# Altium project ASBB.PrjPcb (part 1 of 2)
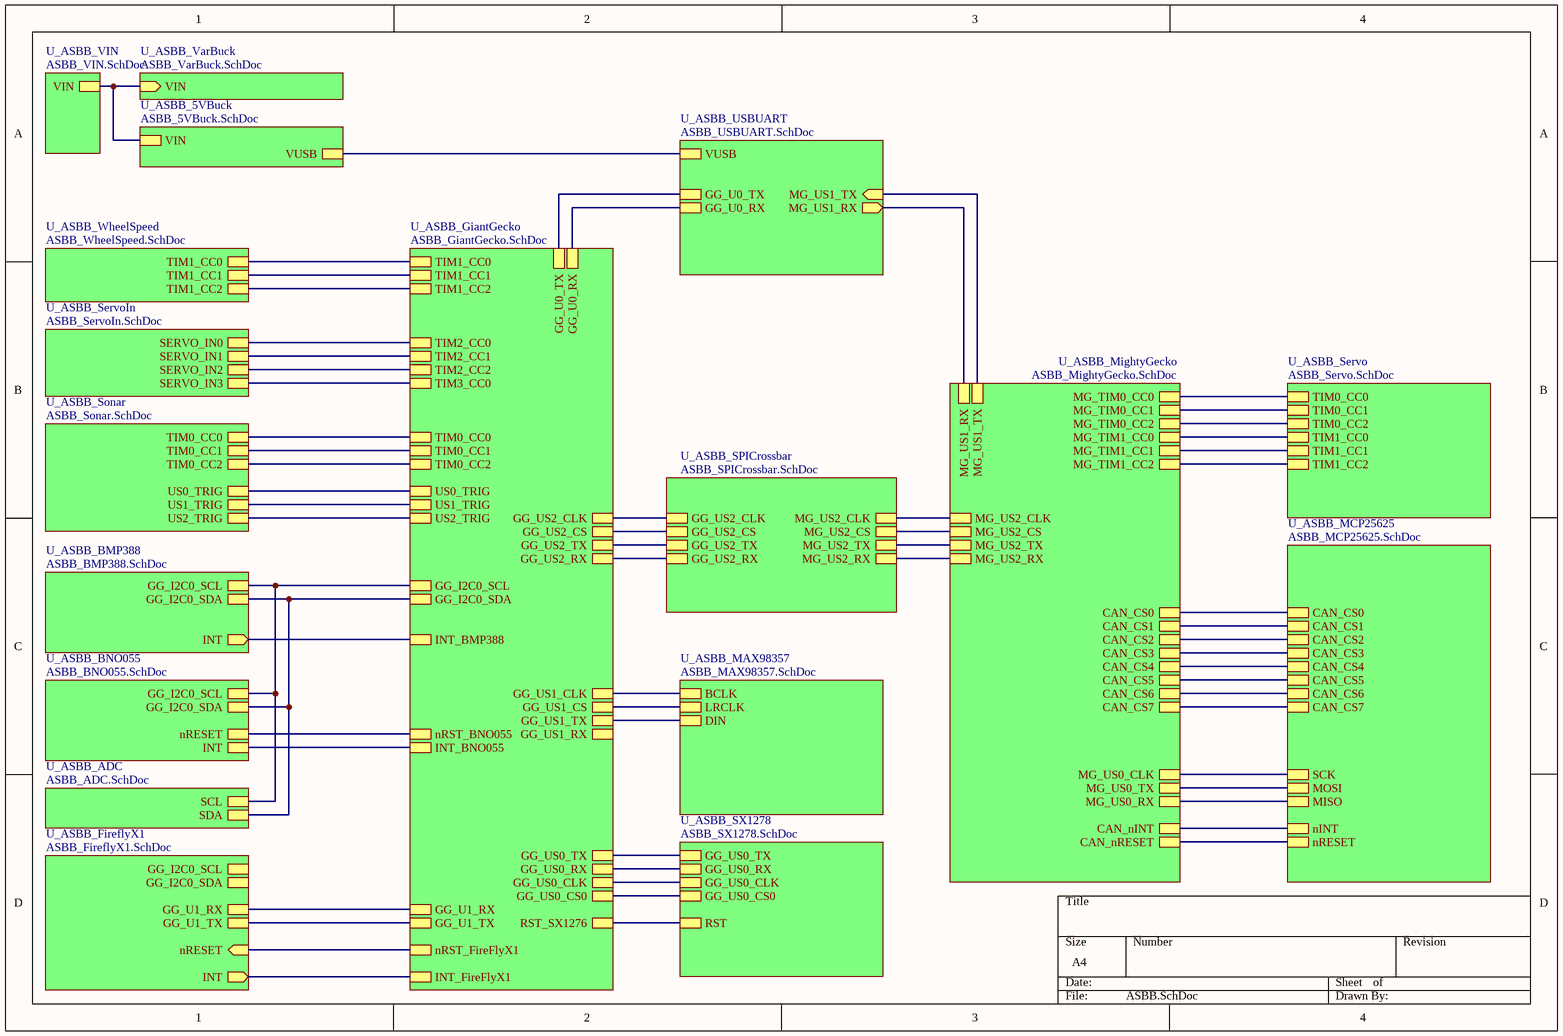
[diagram p0: ASBB.SchDoc]
19 sheets, 226 parts. Net scope: hierarchical (ports join the sheet entries above them; power ports are global).
Board file: ASBB.PcbDoc
Sheets:
  ASBB.SchDoc
    U_ASBB_VarBuck = ASBB_VarBuck.SchDoc
    U_ASBB_5VBuck = ASBB_5VBuck.SchDoc
    U_ASBB_USBUART = ASBB_USBUART.SchDoc
    U_ASBB_BMP388 = ASBB_BMP388.SchDoc
    U_ASBB_BNO055 = ASBB_BNO055.SchDoc
    U_ASBB_MAX98357 = ASBB_MAX98357.SchDoc
    U_ASBB_MCP25625 = ASBB_MCP25625.SchDoc
    U_ASBB_FireflyX1 = ASBB_FireflyX1.SchDoc
    U_ASBB_SX1278 = ASBB_SX1278.SchDoc
    U_ASBB_GiantGecko = ASBB_GiantGecko.SchDoc
    U_ASBB_Servo = ASBB_Servo.SchDoc
    U_ASBB_MightyGecko = ASBB_MightyGecko.SchDoc
    U_ASBB_SPICrossbar = ASBB_SPICrossbar.SchDoc
    U_ASBB_Sonar = ASBB_Sonar.SchDoc
    U_ASBB_WheelSpeed = ASBB_WheelSpeed.SchDoc
    U_ASBB_VIN = ASBB_VIN.SchDoc
    U_ASBB_ADC = ASBB_ADC.SchDoc
    U_ASBB_ServoIn = ASBB_ServoIn.SchDoc

## Sheet ASBB.SchDoc
size A4

### Sub-sheets
U_ASBB_5VBuck = ASBB_5VBuck.SchDoc: VIN, VUSB
U_ASBB_ADC = ASBB_ADC.SchDoc: SDA, SCL
U_ASBB_BMP388 = ASBB_BMP388.SchDoc: INT (out), GG_I2C0_SCL, GG_I2C0_SDA
U_ASBB_BNO055 = ASBB_BNO055.SchDoc: INT, GG_I2C0_SCL, GG_I2C0_SDA, nRESET
U_ASBB_FireflyX1 = ASBB_FireflyX1.SchDoc: INT (out), nRESET (in), GG_U1_TX, GG_I2C0_SCL, GG_U1_RX, GG_I2C0_SDA
U_ASBB_GiantGecko = ASBB_GiantGecko.SchDoc: GG_U0_TX, GG_US1_CLK, GG_US0_CS0, GG_US2_RX, GG_U1_RX, GG_US2_CLK, GG_US1_TX, GG_US0_TX, GG_US2_TX, GG_US1_RX, GG_I2C0_SDA, GG_U1_TX, GG_US2_CS, GG_U0_RX, GG_US0_RX, GG_US1_CS, GG_US0_CLK, GG_I2C0_SCL, INT_BNO055, INT_BMP388, nRST_FireFlyX1, INT_FireFlyX1, RST_SX1276, TIM1_CC1, TIM0_CC0, TIM1_CC0, TIM0_CC2, TIM1_CC2, TIM0_CC1, US2_TRIG, US1_TRIG, US0_TRIG, nRST_BNO055, TIM2_CC0, TIM3_CC0, TIM2_CC2, TIM2_CC1
U_ASBB_MAX98357 = ASBB_MAX98357.SchDoc: BCLK, LRCLK, DIN
U_ASBB_MCP25625 = ASBB_MCP25625.SchDoc: SCK, MOSI, MISO, CAN_CS7, CAN_CS1, CAN_CS4, CAN_CS5, CAN_CS0, CAN_CS3, CAN_CS6, CAN_CS2, nINT, nRESET
U_ASBB_MightyGecko = ASBB_MightyGecko.SchDoc: MG_US0_CLK, MG_US0_RX, MG_US0_TX, MG_US2_CLK, MG_US2_RX, MG_US2_TX, MG_US2_CS, MG_US1_RX, MG_US1_TX, MG_TIM0_CC0, MG_TIM1_CC0, MG_TIM0_CC1, MG_TIM0_CC2, CAN_nRESET, MG_TIM1_CC1, MG_TIM1_CC2, CAN_CS1, CAN_CS0, CAN_CS6, CAN_CS2, CAN_CS4, CAN_CS7, CAN_CS5, CAN_CS3, CAN_nINT
U_ASBB_Servo = ASBB_Servo.SchDoc: TIM0_CC0, TIM0_CC1, TIM0_CC2, TIM1_CC0, TIM1_CC1, TIM1_CC2
U_ASBB_ServoIn = ASBB_ServoIn.SchDoc: SERVO_IN0, SERVO_IN2, SERVO_IN1, SERVO_IN3
U_ASBB_Sonar = ASBB_Sonar.SchDoc: TIM0_CC0, US0_TRIG, TIM0_CC1, US1_TRIG, TIM0_CC2, US2_TRIG
U_ASBB_SPICrossbar = ASBB_SPICrossbar.SchDoc: GG_US2_CLK, GG_US2_TX, GG_US2_CS, MG_US2_CLK, MG_US2_TX, MG_US2_RX, MG_US2_CS, GG_US2_RX
U_ASBB_SX1278 = ASBB_SX1278.SchDoc: RST, GG_US0_TX, GG_US0_RX, GG_US0_CLK, GG_US0_CS0
U_ASBB_USBUART = ASBB_USBUART.SchDoc: GG_U0_TX, GG_U0_RX, MG_US1_TX (in), MG_US1_RX (out), VUSB
U_ASBB_VarBuck = ASBB_VarBuck.SchDoc: VIN (in)
U_ASBB_VIN = ASBB_VIN.SchDoc: VIN
U_ASBB_WheelSpeed = ASBB_WheelSpeed.SchDoc: TIM1_CC0, TIM1_CC1, TIM1_CC2

### Nets
GG_US0_CLK: sheet U_ASBB_SX1278/GG_US0_CLK, sheet U_ASBB_GiantGecko/GG_US0_CLK
GG_US0_RX: sheet U_ASBB_SX1278/GG_US0_RX, sheet U_ASBB_GiantGecko/GG_US0_RX
GG_US0_TX: sheet U_ASBB_SX1278/GG_US0_TX, sheet U_ASBB_GiantGecko/GG_US0_TX
HPC_CS0: sheet U_ASBB_GiantGecko/GG_US2_CS, sheet U_ASBB_SPICrossbar/GG_US2_CS
HPC_CS1: sheet U_ASBB_MightyGecko/MG_US2_CS, sheet U_ASBB_SPICrossbar/MG_US2_CS
HPC_MISO: sheet U_ASBB_GiantGecko/GG_US2_TX, sheet U_ASBB_SPICrossbar/GG_US2_TX
HPC_MOSI: sheet U_ASBB_GiantGecko/GG_US2_RX, sheet U_ASBB_SPICrossbar/GG_US2_RX
HPC_SCK: sheet U_ASBB_GiantGecko/GG_US2_CLK, sheet U_ASBB_MightyGecko/MG_US2_CLK, sheet U_ASBB_SPICrossbar/GG_US2_CLK, sheet U_ASBB_SPICrossbar/MG_US2_CLK
V_IN: sheet U_ASBB_VarBuck/VIN, sheet U_ASBB_5VBuck/VIN, sheet U_ASBB_VIN/VIN
NetB501_13: sheet U_ASBB_FireflyX1/INT, sheet U_ASBB_GiantGecko/INT_FireFlyX1
NetB501_19: sheet U_ASBB_FireflyX1/nRESET, sheet U_ASBB_GiantGecko/nRST_FireFlyX1
NetC1404_2: sheet U_ASBB_5VBuck/VUSB, sheet U_ASBB_USBUART/VUSB
NetIC601_1: sheet U_ASBB_GiantGecko/TIM3_CC0, sheet U_ASBB_ServoIn/SERVO_IN3
NetIC601_9: sheet U_ASBB_GiantGecko/TIM1_CC0, sheet U_ASBB_WheelSpeed/TIM1_CC0
NetIC601_10: sheet U_ASBB_GiantGecko/TIM1_CC1, sheet U_ASBB_WheelSpeed/TIM1_CC1
NetIC601_11: sheet U_ASBB_GiantGecko/TIM1_CC2, sheet U_ASBB_WheelSpeed/TIM1_CC2
NetIC601_18: sheet U_ASBB_MAX98357/LRCLK, sheet U_ASBB_GiantGecko/GG_US1_CS
NetIC601_19: sheet U_ASBB_MAX98357/DIN, sheet U_ASBB_GiantGecko/GG_US1_TX
NetIC601_21: sheet U_ASBB_MAX98357/BCLK, sheet U_ASBB_GiantGecko/GG_US1_CLK
NetIC601_22: sheet U_ASBB_GiantGecko/TIM0_CC0, sheet U_ASBB_Sonar/TIM0_CC0
NetIC601_23: sheet U_ASBB_GiantGecko/TIM0_CC1, sheet U_ASBB_Sonar/TIM0_CC1
NetIC601_26: sheet U_ASBB_GiantGecko/TIM0_CC2, sheet U_ASBB_Sonar/TIM0_CC2
NetIC601_27: sheet U_ASBB_GiantGecko/TIM2_CC0, sheet U_ASBB_ServoIn/SERVO_IN0
NetIC601_28: sheet U_ASBB_GiantGecko/TIM2_CC1, sheet U_ASBB_ServoIn/SERVO_IN1
NetIC601_29: sheet U_ASBB_GiantGecko/TIM2_CC2, sheet U_ASBB_ServoIn/SERVO_IN2
NetIC601_54: sheet U_ASBB_BMP388/INT, sheet U_ASBB_GiantGecko/INT_BMP388
NetIC601_61: sheet U_ASBB_BNO055/nRESET, sheet U_ASBB_GiantGecko/nRST_BNO055
NetIC601_64: sheet U_ASBB_BMP388/GG_I2C0_SDA, sheet U_ASBB_BNO055/GG_I2C0_SDA, sheet U_ASBB_GiantGecko/GG_I2C0_SDA, sheet U_ASBB_ADC/SDA
NetIC601_65: sheet U_ASBB_BMP388/GG_I2C0_SCL, sheet U_ASBB_BNO055/GG_I2C0_SCL, sheet U_ASBB_GiantGecko/GG_I2C0_SCL, sheet U_ASBB_ADC/SCL
NetIC601_67: sheet U_ASBB_GiantGecko/US0_TRIG, sheet U_ASBB_Sonar/US0_TRIG
NetIC601_68: sheet U_ASBB_BNO055/INT, sheet U_ASBB_GiantGecko/INT_BNO055
NetIC601_71: sheet U_ASBB_SX1278/RST, sheet U_ASBB_GiantGecko/RST_SX1276
NetIC601_75: sheet U_ASBB_FireflyX1/GG_U1_TX, sheet U_ASBB_GiantGecko/GG_U1_TX
NetIC601_80: sheet U_ASBB_FireflyX1/GG_U1_RX, sheet U_ASBB_GiantGecko/GG_U1_RX
NetIC601_84: sheet U_ASBB_USBUART/GG_U0_TX, sheet U_ASBB_GiantGecko/GG_U0_TX
NetIC601_85: sheet U_ASBB_USBUART/GG_U0_RX, sheet U_ASBB_GiantGecko/GG_U0_RX
NetIC601_87: sheet U_ASBB_SX1278/GG_US0_CS0, sheet U_ASBB_GiantGecko/GG_US0_CS0
NetIC601_92: sheet U_ASBB_GiantGecko/US1_TRIG, sheet U_ASBB_Sonar/US1_TRIG
NetIC601_93: sheet U_ASBB_GiantGecko/US2_TRIG, sheet U_ASBB_Sonar/US2_TRIG
NetIC901_4: sheet U_ASBB_MCP25625/nINT, sheet U_ASBB_MightyGecko/CAN_nINT
NetIC901_18: sheet U_ASBB_MightyGecko/MG_US2_TX, sheet U_ASBB_SPICrossbar/MG_US2_TX
NetIC901_19: sheet U_ASBB_MCP25625/MOSI, sheet U_ASBB_MightyGecko/MG_US0_TX
NetIC901_20: sheet U_ASBB_MCP25625/MISO, sheet U_ASBB_MightyGecko/MG_US0_RX
NetIC901_21: sheet U_ASBB_MCP25625/SCK, sheet U_ASBB_MightyGecko/MG_US0_CLK
NetIC901_28: sheet U_ASBB_MCP25625/CAN_CS5, sheet U_ASBB_MightyGecko/CAN_CS5
NetIC901_29: sheet U_ASBB_MCP25625/CAN_CS4, sheet U_ASBB_MightyGecko/CAN_CS4
NetIC901_30: sheet U_ASBB_Servo/TIM1_CC2, sheet U_ASBB_MightyGecko/MG_TIM1_CC2
NetIC901_31: sheet U_ASBB_Servo/TIM1_CC1, sheet U_ASBB_MightyGecko/MG_TIM1_CC1
NetIC901_32: sheet U_ASBB_MCP25625/nRESET, sheet U_ASBB_MightyGecko/CAN_nRESET
NetIC901_33: sheet U_ASBB_USBUART/MG_US1_RX, sheet U_ASBB_MightyGecko/MG_US1_RX
NetIC901_34: sheet U_ASBB_USBUART/MG_US1_TX, sheet U_ASBB_MightyGecko/MG_US1_TX
NetIC901_44: sheet U_ASBB_MightyGecko/MG_US2_RX, sheet U_ASBB_SPICrossbar/MG_US2_RX
NetIC901_45: sheet U_ASBB_Servo/TIM0_CC0, sheet U_ASBB_MightyGecko/MG_TIM0_CC0
NetIC901_47: sheet U_ASBB_Servo/TIM0_CC1, sheet U_ASBB_MightyGecko/MG_TIM0_CC1
NetIC901_49: sheet U_ASBB_Servo/TIM0_CC2, sheet U_ASBB_MightyGecko/MG_TIM0_CC2
NetIC901_51: sheet U_ASBB_Servo/TIM1_CC0, sheet U_ASBB_MightyGecko/MG_TIM1_CC0
NetIC901_53: sheet U_ASBB_MCP25625/CAN_CS6, sheet U_ASBB_MightyGecko/CAN_CS6
NetIC901_55: sheet U_ASBB_MCP25625/CAN_CS7, sheet U_ASBB_MightyGecko/CAN_CS7
NetIC901_57: sheet U_ASBB_MCP25625/CAN_CS0, sheet U_ASBB_MightyGecko/CAN_CS0
NetIC901_58: sheet U_ASBB_MCP25625/CAN_CS1, sheet U_ASBB_MightyGecko/CAN_CS1
NetIC901_59: sheet U_ASBB_MCP25625/CAN_CS2, sheet U_ASBB_MightyGecko/CAN_CS2
NetIC901_60: sheet U_ASBB_MCP25625/CAN_CS3, sheet U_ASBB_MightyGecko/CAN_CS3

## Sheet ASBB_VarBuck.SchDoc
size A4
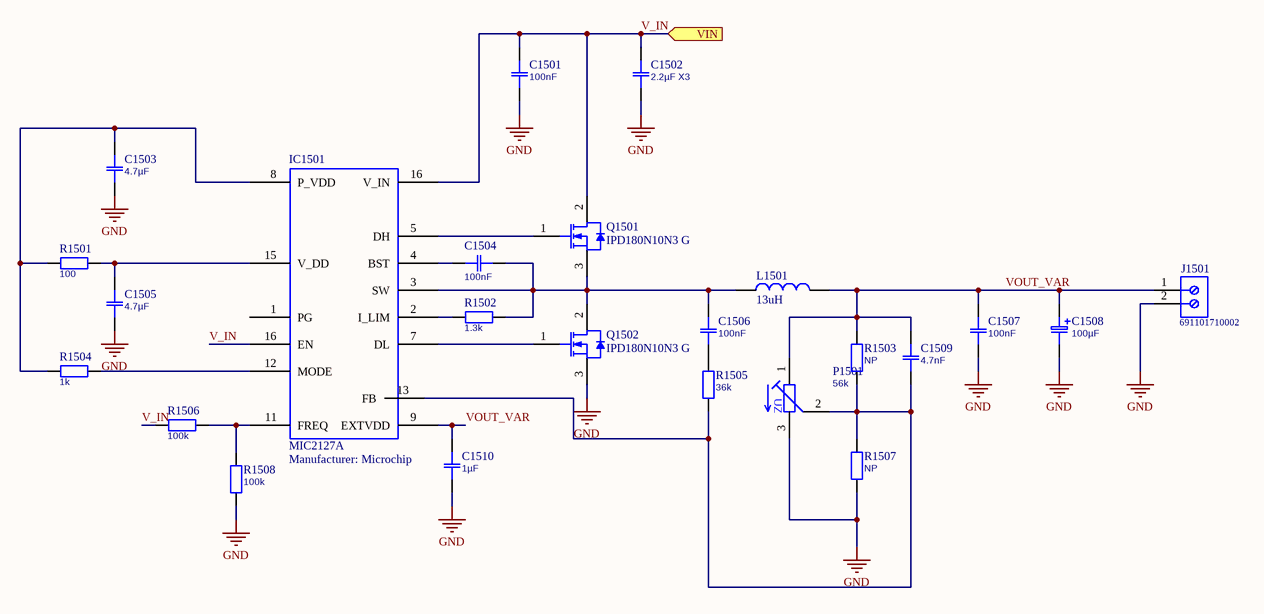
[diagram p1: ASBB_VarBuck.SchDoc]

### Parts
C1501  100nF  [CAP 1206/3216]
C1502  2.2µF X3  [CAP 1206/3216]
C1503  4.7µF  [CAP 1206/3216]
C1504  100nF  [CAP 1206/3216]
C1505  4.7µF  [CAP 1206/3216]
C1506  100nF  [0603]
C1507  100nF  [0603]
C1508  100µF  [CAP ALUM 6.6MM]
C1509  4.7nF  [0603]
C1510  1µF  [0603]
IC1501  MIC2127A  Manufacturer: Microchip  [MCHP-QFN-MG16_N]
J1501  691101710002  [691101710002]
L1501  value 13uH  [WE-HCI_1365_WE-PERM]  (hidden comment: 7443551131)
P1501  56k  [Model 43 Trimmer]
Q1501  IPD180N10N3 G  [INF-PG-TO252-3-11_A_N]
Q1502  IPD180N10N3 G  [INF-PG-TO252-3-11_A_N]
R1501  100  [0603]
R1502  1.3k  [0603]
R1503  NP  [0603]
R1504  1k  [0603]
R1505  36k  [0603]
R1506  100k  [CAP 1206/3216]
R1507  NP  [0603]
R1508  100k  [CAP 1206/3216]

### Ports
VIN (in)

### Nets
GND: C1501.1 C1502.1 C1503.2 C1505.2 C1507.2 C1508.2(-) C1510.2 J1501.2 P1501.3 Q1502.3(SOURCE) R1507.1 R1508.1
V_IN: C1501.2 C1502.2 IC1501.16(EN) Q1501.2(DRAIN) R1506.1 ; port VIN
VOUT_VAR: C1507.1 C1508.1(+) C1509.1 C1510.1 IC1501.9(EXTVDD) J1501.1 L1501.2 P1501.1 R1503.2
NetC1503_1: C1503.1 IC1501.8(P_VDD) R1501.1 R1504.1
NetC1504_1: C1504.1 C1506.1 IC1501.3(SW) L1501.1 Q1501.3(SOURCE) Q1502.2(DRAIN) R1502.2
NetC1504_2: C1504.2 IC1501.4(BST)
NetC1505_1: C1505.1 IC1501.15(V_DD) R1501.2
NetC1506_2: C1506.2 R1505.2
NetC1509_2: C1509.2 IC1501.13(FB) P1501.2 R1503.1 R1505.1 R1507.2
NetIC1501_2: IC1501.2(I_LIM) R1502.1
NetIC1501_5: IC1501.5(DH) Q1501.1(GATE)
NetIC1501_7: IC1501.7(DL) Q1502.1(GATE)
NetIC1501_11: IC1501.11(FREQ) R1506.2 R1508.2
NetIC1501_12: IC1501.12(MODE) R1504.2

Not connected (* = marked no-connect by the designer): IC1501 1(PG)

### Notes on the sheet
- (in symbol Potentiometer) UZ

### Library data of the parts
C1501-C1507 C1509 C1510 = Capacitor: Partnumber: ?; Value: ?
C1508 = Capacitor polarised: Capacitor, polarised; Partnumber: ?; Value: ?
IC1501 = MIC2127A: 75V, Synchronous Buck Controller Featuring ADaptive On-Time Control
J1501 = 691101710002: Series 101 - 5.00 mm Horizontal Entry Modular with Pressure Clamp WR-TBL, 2 pin; Pin Number: 2; Pitch: 5.00 mm; ComponentLink1Description: Manufacturer; ComponentLink1URL: http://www.we-online.de; ComponentLink2Description: Datasheet; ComponentLink2URL: http://katalog.we-online.de/em/datasheet/6911017100xx.pdf; Part Number: 691101710002; Published Date: May 2018; Publisher: Wurth Elektronik; Operating Temperature: -40 to 105 degC; Mounting Technology: THT; Packaging: Box
L1501 = 7443551131: WE-HCI SMD Flat Wire High Current Inductor, size 1365, 10A, 13uH; Material: WE-PERM; ComponentLink1Description: Manufacturer; ComponentLink1URL: http://www.we-online.de; ComponentLink2Description: Datasheet; ComponentLink2URL: http://katalog.we-online.de/pbs/datasheet/7443551131.pdf; Part Number: 7443551131; Published Date: July 2017; Publisher: Wurth Elektronik; Rated Current: 10A; Size: 1365
P1501 = Potentiometer: Partnumber: ?; Value: ?
Q1501 Q1502 = IPD180N10N3 G: N-Channel OptiMOS 3 Power-Transistor, 100 V VDS, 43 A ID, -55 to 175 degC, PG-TO252-3-11, Reel, Green; Manufacturer: Infineon; Green: TRUE; ID (max): 43 A; IDpuls (max): 172 A; Polarity: N; Ptot (max): 71 W; QG: 19 nC; RDS (on) (max): 18 mOhm; Rth: 2.1 K/W; RthJA (max): 75 K/W; VDS (max): 100 V; VGS(th) (max): 3.5 V; VGS(th) (min): 2 V; DatasheetVersion: Rev. 2.2; PackageVersion: Rev. 02, 03/2007; PackageReference: PG-TO252-3-11; PackageDescription: 3-Pin Plastic (Green) Transistor Single Outline Package, 6.57 x 6.1 mm Body, 2.29 mm Pitch; Supplier 1: Digi-Key; Supplier Part Number 1: IPD180N10N3 GTR-ND; Supplier 2: Digi-Key; Supplier Part Number 2: IPD180N10N3 GCT-ND; Supplier 3: Digi-Key; Supplier Part Number 3: IPD180N10N3 GDKR-ND; Packing: Reel; RthJC (max): 2.1 K/W; Mounting Technology: Surface Mount; PartNumber: IPD180N10N3 G; ComponentLink1Description: Manufacturer URL; ComponentLink1URL: http://www.infineon.com/; ComponentLink2Description: Datasheet; ComponentLink2URL: http://www.infineon.com/dgdl/IPD180N10N3+G_Rev2.2.pdf?folderId=db3a304313b8b5a60113cee8763b02d7&fileId=db3a30432239cccd01226070a4bb7fb9; ComponentLink3Description: Package Specification; ComponentLink3URL: http://www.infineon.com/dgdl/IPD160N04L_rev1.0.pdf?folderId=db3a3043163797a6011643468e7505a4&fileId=db3a3043163797a60116436401cf05cf
R1501-R1508 = Resistor: Partnumber: ?; Value: ?

## Sheet ASBB_5VBuck.SchDoc
size A4
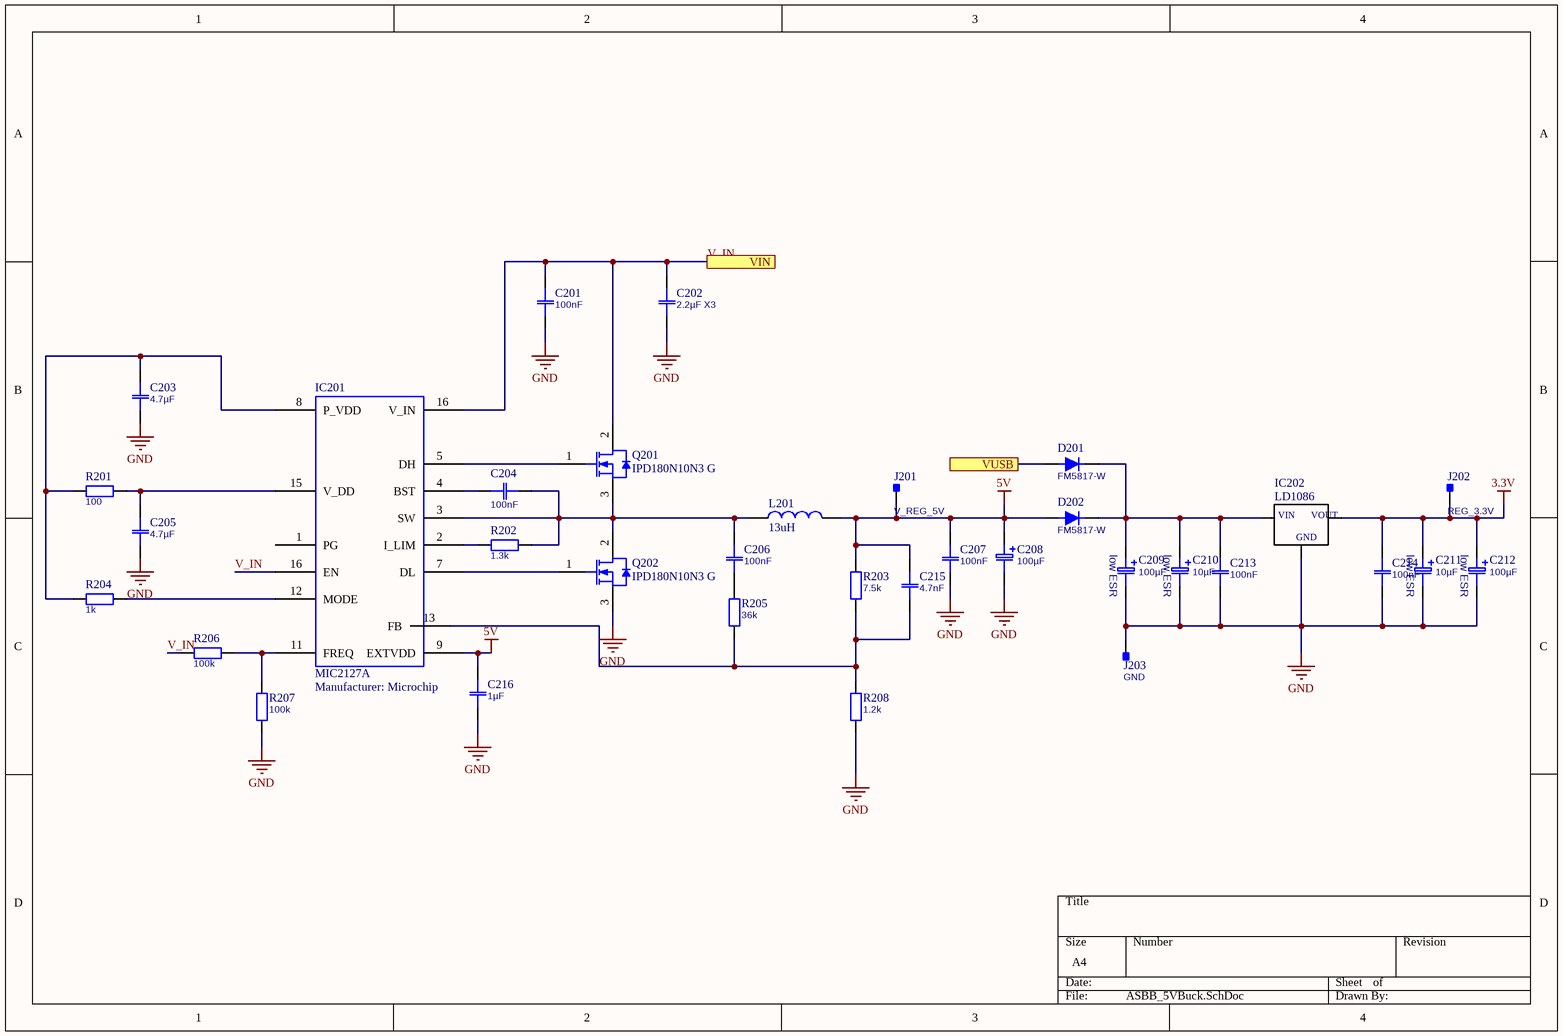
[diagram p2: ASBB_5VBuck.SchDoc]

### Parts
C201  100nF  [CAP 1206/3216]
C202  2.2µF X3  [CAP 1206/3216]
C203  4.7µF  [CAP 1206/3216]
C204  100nF  [CAP 1206/3216]
C205  4.7µF  [CAP 1206/3216]
C206  100nF  [0603]
C207  100nF  [0603]
C208  100µF  [CAP ALUM 6.6MM]
C209  100µF  [CAP ALUM 6.6MM]
C210  10µF  [CAP ALUM 6.6MM]
C211  10µF  [CAP ALUM 6.6MM]
C212  100µF  [CAP ALUM 6.6MM]
C213  100nF  [0603]
C214  100nF  [0603]
C215  4.7nF  [0603]
C216  1µF  [0603]
D201  FM5817-W  [SMB]
D202  FM5817-W  [SMB]
IC201  MIC2127A  Manufacturer: Microchip  [MCHP-QFN-MG16_N]
IC202  LD1086  [D2PAK_LD1086(Primary)]
J201  V_REG_5V  [PIN1]
J202  REG_3.3V  [PIN1]
J203  GND  [PIN1]
L201  value 13uH  [WE-HCI_1365_WE-PERM]  (hidden comment: 7443551131)
Q201  IPD180N10N3 G  [INF-PG-TO252-3-11_A_N]
Q202  IPD180N10N3 G  [INF-PG-TO252-3-11_A_N]
R201  100  [0603]
R202  1.3k  [0603]
R203  7.5k  [0603]
R204  1k  [0603]
R205  36k  [0603]
R206  100k  [CAP 1206/3216]
R207  100k  [CAP 1206/3216]
R208  1.2k  [0603]

### Ports
VIN, VUSB

### Nets
3.3V: C211.1(+) C212.1(+) C214.2 IC202.VOUT J202.1
5V: C207.1 C208.1(+) C215.1 C216.1 D202.2(A) IC201.9(EXTVDD) J201.1 L201.2 R203.2
GND: C201.1 C202.1 C203.2 C205.2 C207.2 C208.2(-) C209.2(-) C210.2(-) C211.2(-) C212.2(-) C213.1 C214.1 C216.2 IC202.GND J203.1 Q202.3(SOURCE) R207.1 R208.1
V_IN: C201.2 C202.2 IC201.16(EN) Q201.2(DRAIN) R206.1 ; port VIN
NetC203_1: C203.1 IC201.8(P_VDD) R201.1 R204.1
NetC204_1: C204.1 C206.1 IC201.3(SW) L201.1 Q201.3(SOURCE) Q202.2(DRAIN) R202.2
NetC204_2: C204.2 IC201.4(BST)
NetC205_1: C205.1 IC201.15(V_DD) R201.2
NetC206_2: C206.2 R205.2
NetC209_1: C209.1(+) C210.1(+) C213.2 D201.1(C) D202.1(C) IC202.VIN
NetC215_2: C215.2 IC201.13(FB) R203.1 R205.1 R208.2
NetC1404_2: D201.2(A) ; port VUSB
NetIC201_2: IC201.2(I_LIM) R202.1
NetIC201_5: IC201.5(DH) Q201.1(GATE)
NetIC201_7: IC201.7(DL) Q202.1(GATE)
NetIC201_11: IC201.11(FREQ) R206.2 R207.2
NetIC201_12: IC201.12(MODE) R204.2

Not connected (* = marked no-connect by the designer): IC201 1(PG)

### Notes on the sheet
- (in symbol Capacitor polarised low ESR) low ESR

### Library data of the parts
C201-C207 C213-C216 = Capacitor: Partnumber: ?; Value: ?
C208 = Capacitor polarised: Capacitor, polarised; Partnumber: ?; Value: ?
C209-C212 = Capacitor polarised low ESR: Capacitor, polarised, low ESR; Partnumber: ?; Value: ?
D201 D202 = Diode: Partnumber: ?; Value: ?
IC201 = MIC2127A: as IC1501 on sheet ASBB_VarBuck
IC202 = LD1086: Semiconductors and Actives; MF: STMicroelectronics; MP: LD1086; Availability: Unavailable; SnapEDA_Link: https://www.snapeda.com/parts/LD1086/STMicroelectronics/view-part/?ref=snap; Package: None; Price: None; Value: *
J201-J203 = Pad 1 Pin: Pad, 1 Pin
L201 = 7443551131: as L1501 on sheet ASBB_VarBuck; ComponentLink1Description: Manufacturer; ComponentLink1URL: http://www.we-online.de; ComponentLink2Description: Datasheet; ComponentLink2URL: http://katalog.we-online.de/pbs/datasheet/7443551131.pdf; Part Number: 7443551131; Published Date: July 2017; Publisher: Wurth Elektronik; Rated Current: 10A; Size: 1365
Q201 Q202 = IPD180N10N3 G: as Q1501 on sheet ASBB_VarBuck; DatasheetVersion: Rev. 2.2; PackageVersion: Rev. 02, 03/2007; PackageReference: PG-TO252-3-11; PackageDescription: 3-Pin Plastic (Green) Transistor Single Outline Package, 6.57 x 6.1 mm Body, 2.29 mm Pitch; Supplier 1: Digi-Key; Supplier Part Number 1: IPD180N10N3 GTR-ND; Supplier 2: Digi-Key; Supplier Part Number 2: IPD180N10N3 GCT-ND; Supplier 3: Digi-Key; Supplier Part Number 3: IPD180N10N3 GDKR-ND; Packing: Reel; RthJC (max): 2.1 K/W; Mounting Technology: Surface Mount; PartNumber: IPD180N10N3 G; ComponentLink1Description: Manufacturer URL; ComponentLink1URL: http://www.infineon.com/; ComponentLink2Description: Datasheet; ComponentLink2URL: http://www.infineon.com/dgdl/IPD180N10N3+G_Rev2.2.pdf?folderId=db3a304313b8b5a60113cee8763b02d7&fileId=db3a30432239cccd01226070a4bb7fb9; ComponentLink3Description: Package Specification; ComponentLink3URL: http://www.infineon.com/dgdl/IPD160N04L_rev1.0.pdf?folderId=db3a3043163797a6011643468e7505a4&fileId=db3a3043163797a60116436401cf05cf
R201-R208 = Resistor: Partnumber: ?; Value: ?

## Sheet ASBB_USBUART.SchDoc
size A4
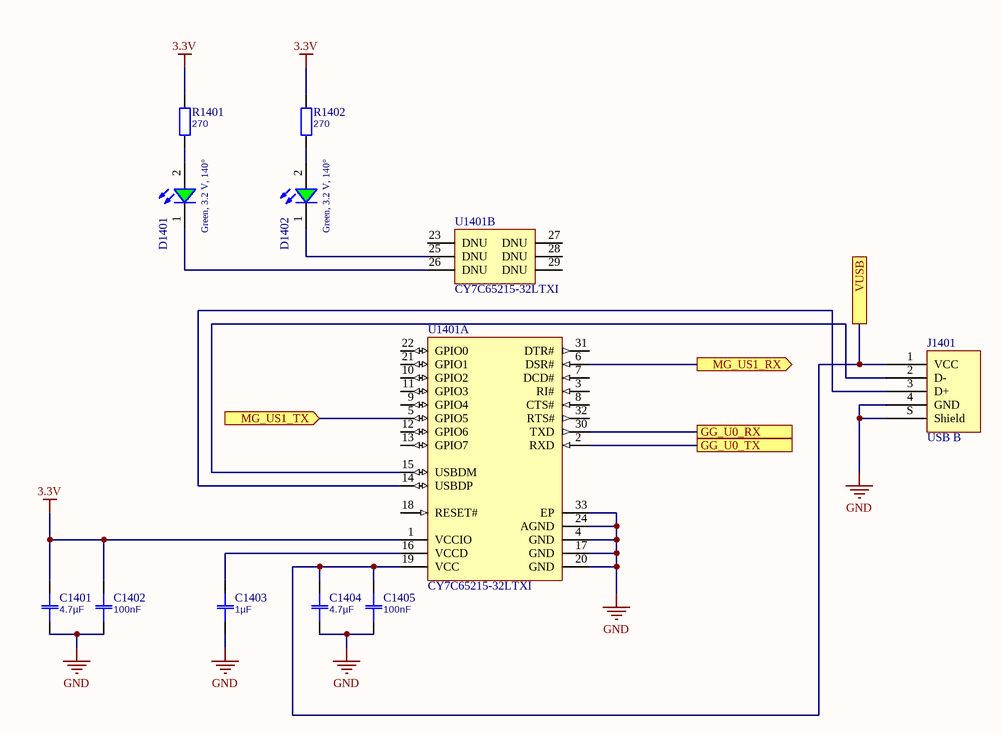
[diagram p3: ASBB_USBUART.SchDoc]

### Parts
C1401  4.7µF  [0603]
C1402  100nF  [0603]
C1403  1µF  [0603]
C1404  4.7µF  [0603]
C1405  100nF  [0603]
D1401  Green, 3.2 V, 140°  [WL-SMCW_0603]
D1402  Green, 3.2 V, 140°  [WL-SMCW_0603]
J1401  USB B  [FCI USB 10118193-0001LF]
R1401  270  [0603]
R1402  270  [0603]
U1401  CY7C65215-32LTXI  [CYP-LTX32_N]  (parts A,B of 2)

### Ports
GG_U0_RX, GG_U0_TX, MG_US1_RX (out), MG_US1_TX (in), VUSB

### Nets
3.3V: C1401.2 C1402.2 R1401.2 R1402.2 U1401.1(VCCIO)
GND: C1401.1 C1402.1 C1403.1 C1404.1 C1405.1 J1401.4(GND) J1401.S(Shield) U1401.4(GND) U1401.17(GND) U1401.20(GND) U1401.24(AGND) U1401.33(EP)
NetC1403_2: C1403.2 U1401.16(VCCD)
NetC1404_2: C1404.2 C1405.2 J1401.1(VCC) U1401.19(VCC) ; port VUSB
NetD1401_1: D1401.1(K) U1401.26(DNU)
NetD1401_2: D1401.2(A) R1401.1
NetD1402_1: D1402.1(K) U1401.25(DNU)
NetD1402_2: D1402.2(A) R1402.1
NetIC601_84: U1401.2(RXD) ; port GG_U0_TX
NetIC601_85: U1401.30(TXD) ; port GG_U0_RX
NetIC901_33: U1401.6(DSR#) ; port MG_US1_RX
NetIC901_34: U1401.5(GPIO5) ; port MG_US1_TX
NetJ1401_2: J1401.2(D-) U1401.15(USBDM)
NetJ1401_3: J1401.3(D+) U1401.14(USBDP)

Not connected (* = marked no-connect by the designer): U1401 3(RI#) 7(DCD#) 8(CTS#) 9(GPIO4) 10(GPIO2) 11(GPIO3) 12(GPIO6) 13(GPIO7) 18(RESET#) 21(GPIO1) 22(GPIO0) 23(DNU) 27(DNU) 28(DNU) 29(DNU) 31(DTR#) 32(RTS#)

### Library data of the parts
C1401-C1405 = Capacitor: Partnumber: ?; Value: ?
D1401 D1402 = 150060GS75000: WL-SMCW SMD Mono-color Chip LED Waterclear, size 0603, Green, 3.2 V, 140°; Forward Voltage: 3.2 V; Peak Wavelength: 515 nm; Dominant Wavelength: 525 nm; Luminous Intensity: 430 mcd; ComponentLink1Description: Manufacturer; ComponentLink1URL: http://www.we-online.de; ComponentLink2Description: Datasheet; ComponentLink2URL: http://katalog.we-online.de/led/datasheet/150060GS75000.pdf; Part Number: 150060GS75000; Published Date: May 2018; Publisher: Wurth Elektronik; Size: 0603; Viewing Angle: 140°; Operating Temperature: -40 to 85 degC; Emitting Color: Green; Mounting Technology: SMT
J1401 = USB 2.0 Type B
R1401 R1402 = Resistor: Partnumber: ?; Value: ?
U1401 = CY7C65215-32LTXI: USB-Serial Dual Channel (UART/I2C/SPI) Bridge with CapSense(R) and BCD, 0.5 KB, 19 I/Os, 1.71 to 5.5 V, -40 to 85 degC, 32-Pin QFN (LTX32), Tray; Manufacturer: Cypress; CPU Core: M8; Max. Operating Voltage (V): 5.5; Memory Architecture: Flash; Memory Size (KB): 0.5; Min. Operating Voltage (V): 1.71; No. of I/Os: 19; DatasheetVersion: Rev. *F; PackageVersion: Rev. *D, 09/2012; PackageReference: LTX32; PackageDescription: 32-Pin Sawn QFN, Body 5 x 5 mm, Pitch 0.5 mm; Supplier 1: Digi-Key; Supplier Part Number 1: CY7C65215-32LTXI-ND; Supplier 2: Farnell; Supplier Part Number 2: 2345649; Supplier 3: Newark; Supplier Part Number 3: 06X1915; Supplier 4: Mouser; Supplier Part Number 4: 727-CY7C65215-32LTXI; Max. Operating Temp. (degreesC): 85; Min. Operating Temp. (degreesC): -40; Packing: Tray; RoHS: Pb-Free; Mounting Technology: Surface Mount; Code_JEDEC: MO-220; PartNumber: CY7C65215-32LTXI; ComponentLink1Description: Manufacturer URL; ComponentLink1URL: http://www.cypress.com/; ComponentLink2Description: Datasheet; ComponentLink2URL: http://www.cypress.com/?docID=45712; ComponentLink3Description: Package Specification; ComponentLink3URL: http://www.cypress.com/?docID=39513

## Sheet ASBB_BMP388.SchDoc
size A4
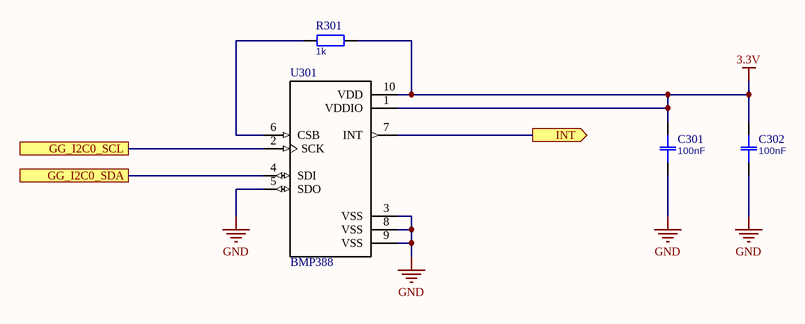
[diagram p4: ASBB_BMP388.SchDoc]

### Parts
C301  100nF  [0603]
C302  100nF  [0603]
R301  1k  [0603]
U301  BMP388  [PQFN50P200X200X80-10N]

### Ports
GG_I2C0_SCL, GG_I2C0_SDA, INT (out)

### Nets
3.3V: C301.2 C302.2 R301.2 U301.1(VDDIO) U301.10(VDD)
GND: C301.1 C302.1 U301.3(VSS) U301.5(SDO) U301.8(VSS) U301.9(VSS)
NetIC601_54: U301.7(INT) ; port INT
NetIC601_64: U301.4(SDI) ; port GG_I2C0_SDA
NetIC601_65: U301.2(SCK) ; port GG_I2C0_SCL
NetR301_1: R301.1 U301.6(CSB)

### Library data of the parts
C301 C302 = Capacitor: Partnumber: ?; Value: ?
R301 = Resistor: Partnumber: ?; Value: ?
U301 = BMP388: P-Sensor SPI I2C 1, 25 Bar SMD; MF: Bosch Sensortec; MP: BMP388; Availability: Unavailable; SnapEDA_Link: https://www.snapeda.com/parts/BMP388/Bosch%20Sensortec/view-part/?ref=snap; Package: WFLGA-10 Bosch Tools; Price: None; Value: *

## Sheet ASBB_BNO055.SchDoc
size A4
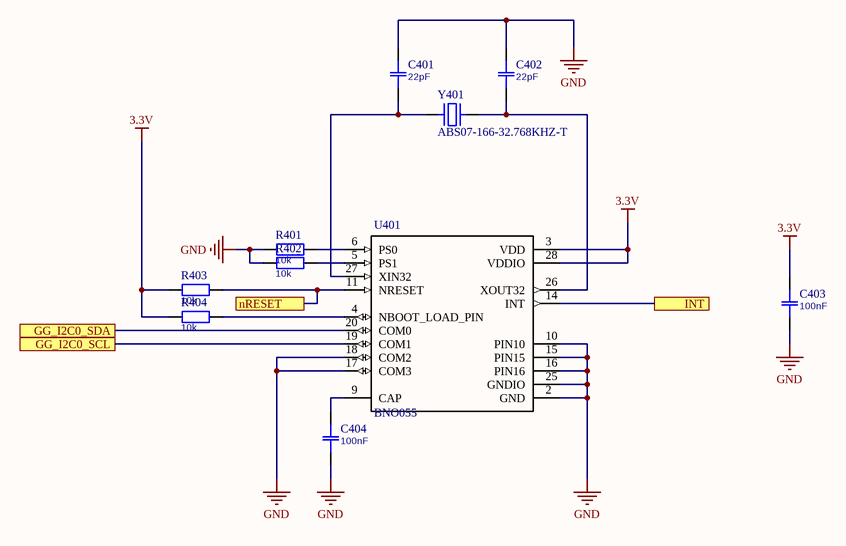
[diagram p5: ASBB_BNO055.SchDoc]

### Parts
C401  22pF  [0603]
C402  22pF  [0603]
C403  100nF  [0603]
C404  100nF  [0603]
R401  10k  [0603]
R402  10k  [0603]
R403  10k  [0603]
R404  10k  [0603]
U401  BNO055  [LGA28R50P4X10_380X520X100]
Y401  ABS07-166-32.768KHZ-T  [ABRACON ABS07]

### Ports
GG_I2C0_SCL, GG_I2C0_SDA, INT, nRESET

### Nets
3.3V: C403.2 R403.1 R404.1 U401.3(VDD) U401.28(VDDIO)
GND: C401.2 C402.2 C403.1 C404.1 R401.1 R402.1 U401.2(GND) U401.10(PIN10) U401.15(PIN15) U401.16(PIN16) U401.17(COM3) U401.18(COM2) U401.25(GNDIO)
NetC401_1: C401.1 U401.27(XIN32) Y401.1
NetC402_1: C402.1 U401.26(XOUT32) Y401.2
NetC404_2: C404.2 U401.9(CAP)
NetIC601_61: R403.2 U401.11(NRESET) ; port nRESET
NetIC601_64: U401.20(COM0) ; port GG_I2C0_SDA
NetIC601_65: U401.19(COM1) ; port GG_I2C0_SCL
NetIC601_68: U401.14(INT) ; port INT
NetR401_2: R401.2 U401.6(PS0)
NetR402_2: R402.2 U401.5(PS1)
NetR404_2: R404.2 U401.4(NBOOT_LOAD_PIN)

### Library data of the parts
C401-C404 = Capacitor: Partnumber: ?; Value: ?
R401-R404 = Resistor: Partnumber: ?; Value: ?
U401 = BNO055: BNO055 9-axis Absolute Orientation Sensor _ SiP _ w/Sensors and Sensor Fusion; MF: Bosch; MP: BNO055; SnapEDA_Link: https://www.snapeda.com/parts/BNO055/Bosch%20Sensortec/view-part/?ref=snap; Package: LGA-28 Bosch; Availability: Unavailable; Price: None; Value: *
Y401 = Abracon Crystal ABS06: SMT Crystal

## Sheet ASBB_MAX98357.SchDoc
size A4
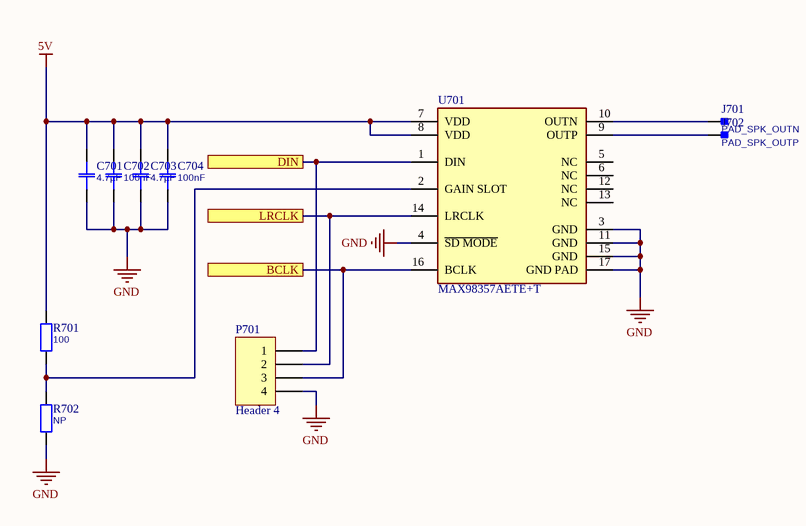
[diagram p6: ASBB_MAX98357.SchDoc]

### Parts
C701  4.7µF  [0603]
C702  100nF  [0603]
C703  4.7µF  [0603]
C704  100nF  [0603]
J701  PAD_SPK_OUTN  [PIN1]
J702  PAD_SPK_OUTP  [PIN1]
P701  Header 4  [HDR1X4]
R701  100  [0603]
R702  NP  [0603]
U701  Part Number: MAX98357AETE+T  [Maxim_Electronics_21-0896_0]  (hidden comment: IC_Maxim_Electronics_MAX98357AETE+T_eec)

### Ports
BCLK, DIN, LRCLK

### Nets
5V: C701.2 C702.2 C703.2 C704.2 R701.2 U701.7(VDD) U701.8(VDD)
GND: C701.1 C702.1 C703.1 C704.1 P701.4 R702.1 U701.3(GND) U701.4(~{SD_MODE}) U701.11(GND) U701.15(GND) U701.17(GND_PAD)
NetIC601_18: P701.2 U701.14(LRCLK) ; port LRCLK
NetIC601_19: P701.1 U701.1(DIN) ; port DIN
NetIC601_21: P701.3 U701.16(BCLK) ; port BCLK
NetJ701_1: J701.1 U701.10(OUTN)
NetJ702_1: J702.1 U701.9(OUTP)
NetR701_1: R701.1 R702.2 U701.2(GAIN_SLOT)

Not connected (* = marked no-connect by the designer): U701 5(NC) 6(NC) 12(NC) 13(NC)

### Library data of the parts
C701-C704 = Capacitor: Partnumber: ?; Value: ?
J701 J702 = Pad 1 Pin: Pad, 1 Pin
P701 = Header 4: Header, 4-Pin; LatestRevisionDate: 17-Jul-2002; LatestRevisionNote: Re-released for DXP Platform.; Publisher: Altium Limited
R701 R702 = Resistor: Partnumber: ?; Value: ?
U701 = IC_Maxim_Electronics_MAX98357AETE+T_eec: IC Amplifier IC 2-Channel (Stereo) Class D 16-TQFN (3x3); Manufacturer: Maxim Electronics; Mfg Package Ident: 21-0896; helpURL: https://upverter.com/upn/revision/0f54a4b5bdb80fd2/; ComponentLink2Description: Datasheet; Temperature: +40°C to +85°C; Package: 21-0896; Supplier 2: Mouser; Price: 1.00367999051; Supplier 1: Digi-Key; ComponentLink1URL: https://upverter.com/upn/revision/0f54a4b5bdb80fd2/; Supplier Part Number 2: 700-MAX98357AETE+T; Supplier Part Number 1: MAX98357AETE+T-ND; ComponentLink1Description: Upverter; ComponentLink2URL: http://datasheets.maximintegrated.com/en/ds/MAX98357A-MAX98357B.pdf; RoHS: TRUE; Mouser Part Number: 700-MAX98357AETE+T; Temperature Range High: +85°C; Digikey Description: IC Amplifier IC 2-Channel (Stereo) Class D 16-TQFN (3x3); Digikey Part Number: MAX98357AETE+T-ND; Lead Free: yes; Temperature Range Low: +40°C

## Sheet ASBB_MCP25625.SchDoc
size A4
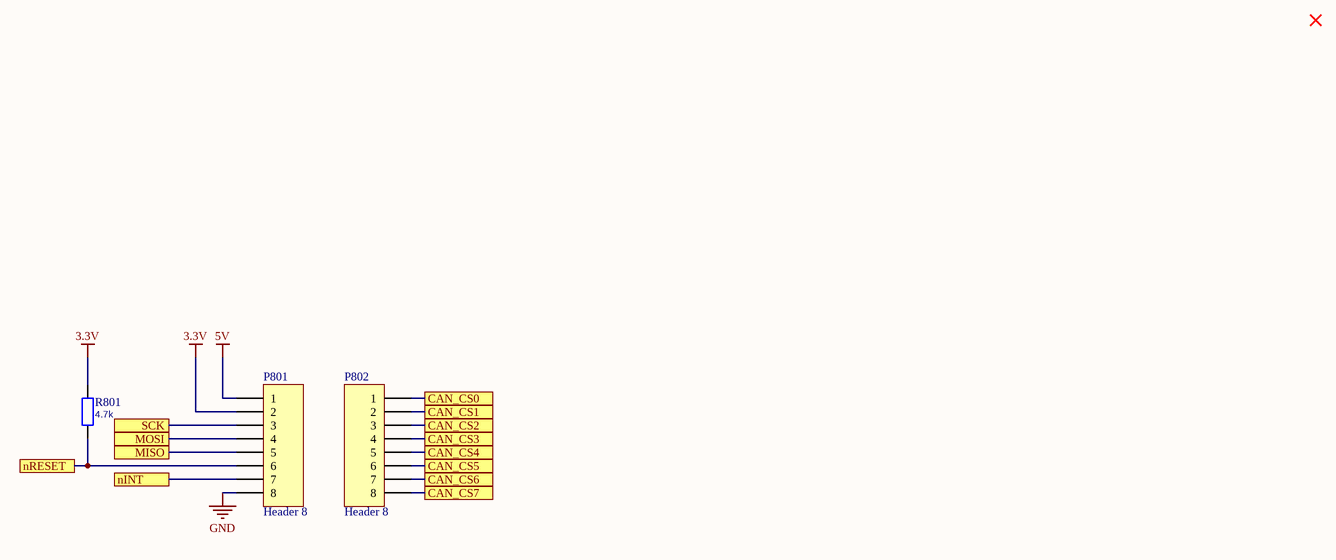
[diagram p7: ASBB_MCP25625.SchDoc]

### Parts
P801  Header 8  [HDR1X8]
P802  Header 8  [HDR1X8]
R801  4.7k  [0603]

### Ports
CAN_CS0, CAN_CS1, CAN_CS2, CAN_CS3, CAN_CS4, CAN_CS5, CAN_CS6, CAN_CS7, MISO, MOSI, nINT, nRESET, SCK

### Nets
3.3V: P801.2 R801.2
5V: P801.1
GND: P801.8
NetIC901_4: P801.7 ; port nINT
NetIC901_19: P801.4 ; port MOSI
NetIC901_20: P801.5 ; port MISO
NetIC901_21: P801.3 ; port SCK
NetIC901_28: P802.6 ; port CAN_CS5
NetIC901_29: P802.5 ; port CAN_CS4
NetIC901_32: P801.6 R801.1 ; port nRESET
NetIC901_53: P802.7 ; port CAN_CS6
NetIC901_55: P802.8 ; port CAN_CS7
NetIC901_57: P802.1 ; port CAN_CS0
NetIC901_58: P802.2 ; port CAN_CS1
NetIC901_59: P802.3 ; port CAN_CS2
NetIC901_60: P802.4 ; port CAN_CS3

### Library data of the parts
P801 P802 = Header 8: Header, 8-Pin; LatestRevisionDate: 17-Jul-2002; LatestRevisionNote: Re-released for DXP Platform.; Publisher: Altium Limited
R801 = Resistor: Partnumber: ?; Value: ?

## Sheet ASBB_FireflyX1.SchDoc
size A4
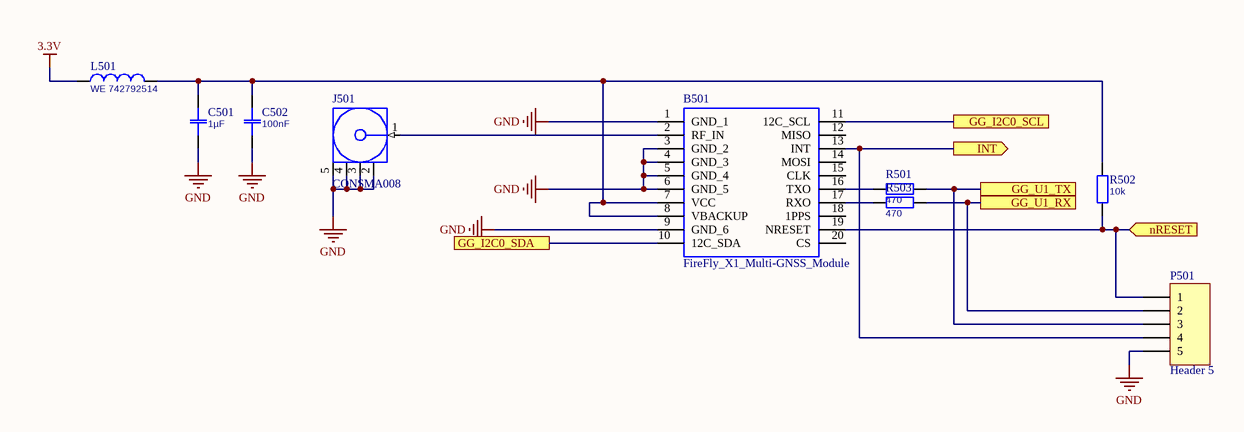
[diagram p8: ASBB_FireflyX1.SchDoc]

### Parts
B501  FireFly_X1_Multi-GNSS_Module  [X-1]
C501  1µF  [0603]
C502  100nF  [0603]
J501  CONSMA008  [CON-SMA-L]
L501  WE 742792514  [1812]
P501  Header 5  [HDR1X5]
R501  470  [0603]
R502  10k  [0603]
R503  470  [0603]

### Ports
GG_I2C0_SCL, GG_I2C0_SDA, GG_U1_RX, GG_U1_TX, INT (out), nRESET (in)

### Nets
3.3V: L501.1
GND: B501.1(GND_1) B501.3(GND_2) B501.4(GND_3) B501.5(GND_4) B501.6(GND_5) B501.9(GND_6) C501.1 C502.1 J501.2(GND) J501.3(GND) J501.4(GND) J501.5(GND) P501.5
NetB501_2: B501.2(RF_IN) J501.1(Signal)
NetB501_7: B501.7(VCC) B501.8(VBACKUP) C501.2 C502.2 L501.2 R502.2
NetB501_10: B501.10(12C_SDA) ; port GG_I2C0_SDA
NetB501_11: B501.11(12C_SCL) ; port GG_I2C0_SCL
NetB501_13: B501.13(INT) P501.4 ; port INT
NetB501_16: B501.16(TXO) R501.1
NetB501_17: B501.17(RXO) R503.1
NetB501_19: B501.19(NRESET) P501.1 R502.1 ; port nRESET
NetIC601_75: P501.3 R501.2 ; port GG_U1_TX
NetIC601_80: P501.2 R503.2 ; port GG_U1_RX

Not connected (* = marked no-connect by the designer): B501 12(MISO) 14(MOSI) 15(CLK) 18(1PPS) 20(CS)

### Library data of the parts
B501 = FireFly_X1_Multi-GNSS_Module: Dual system GNSS receiver Module, QFN-20; Manufacturer_Name: GlobalTop Technology Inc.; Manufacturer_Part_Number: FireFly X1 Multi-GNSS Module; RS Part Number: *; RS Price/Stock: *; Arrow Part Number: FireFly X1 Multi-GNSS Module; Arrow Price/Stock: *; Datasheet Link: http://www.gtop-tech.com/manage/upload/product/1460546926_57255.pdf
C501 C502 = Capacitor: Partnumber: ?; Value: ?
J501 = CONSMA008: SMA Female PCB Mount Connector - Extended; DatasheetVersion: revB, Feb-2010; PackageVersion: revB, Feb-2010; PackageReference: CON-SMA-L; PackageDescription: SMA Female PCB Mount Connector, Extended, Thru-Hole, 7 x 7 mm Body; ComponentLink1Description: Manufacturer URL; ComponentLink1URL: http://www.linxtechnologies.com/; ComponentLink2Description: Datasheet; ComponentLink2URL: http://www.connectorcity.com/diagrams/SMA/CONSMA008.pdf
L501 = Inductor: Partnumber: ?; Value: ?
P501 = Header 5: Header, 5-Pin; LatestRevisionDate: 17-Jul-2002; LatestRevisionNote: Re-released for DXP Platform.; Publisher: Altium Limited
R501-R503 = Resistor: Partnumber: ?; Value: ?

## Sheet ASBB_SX1278.SchDoc
size A4
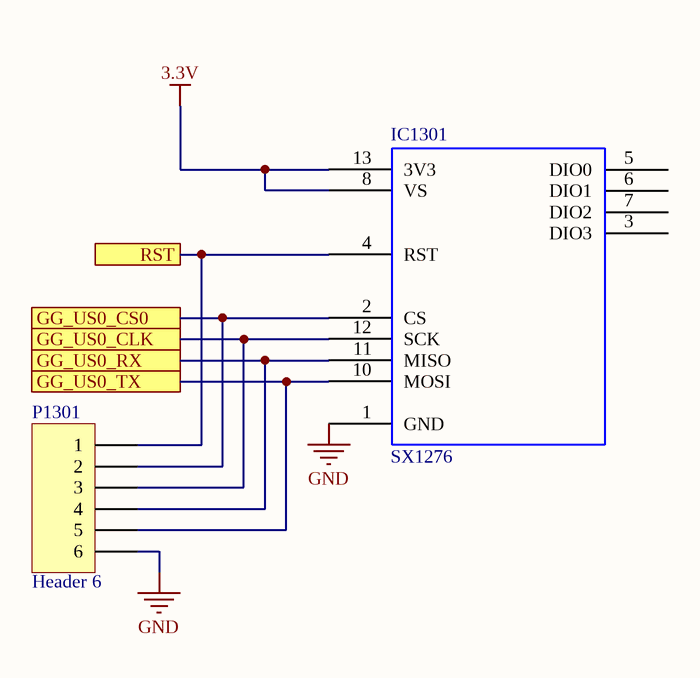
[diagram p9: ASBB_SX1278.SchDoc]

### Parts
IC1301  SX1276  [Modtronix inAir9]
P1301  Header 6  [HDR1X6]

### Ports
GG_US0_CLK, GG_US0_CS0, GG_US0_RX, GG_US0_TX, RST

### Nets
3.3V: IC1301.8(VS) IC1301.13(3V3)
GND: IC1301.1(GND) P1301.6
GG_US0_CLK: IC1301.12(SCK) P1301.3 ; port GG_US0_CLK
GG_US0_RX: IC1301.11(MISO) P1301.4 ; port GG_US0_RX
GG_US0_TX: IC1301.10(MOSI) P1301.5 ; port GG_US0_TX
NetIC601_71: IC1301.4(RST) P1301.1 ; port RST
NetIC601_87: IC1301.2(CS) P1301.2 ; port GG_US0_CS0

Not connected (* = marked no-connect by the designer): IC1301 3(DIO3) 5(DIO0) 6(DIO1) 7(DIO2) 9(NC) 14(NC)

### Library data of the parts
IC1301 = Modtronix inAir9: Modtronix LoRa Transceiver
P1301 = Header 6: Header, 6-Pin; LatestRevisionDate: 17-Jul-2002; LatestRevisionNote: Re-released for DXP Platform.; Publisher: Altium Limited

## Sheet ASBB_GiantGecko.SchDoc
size A4
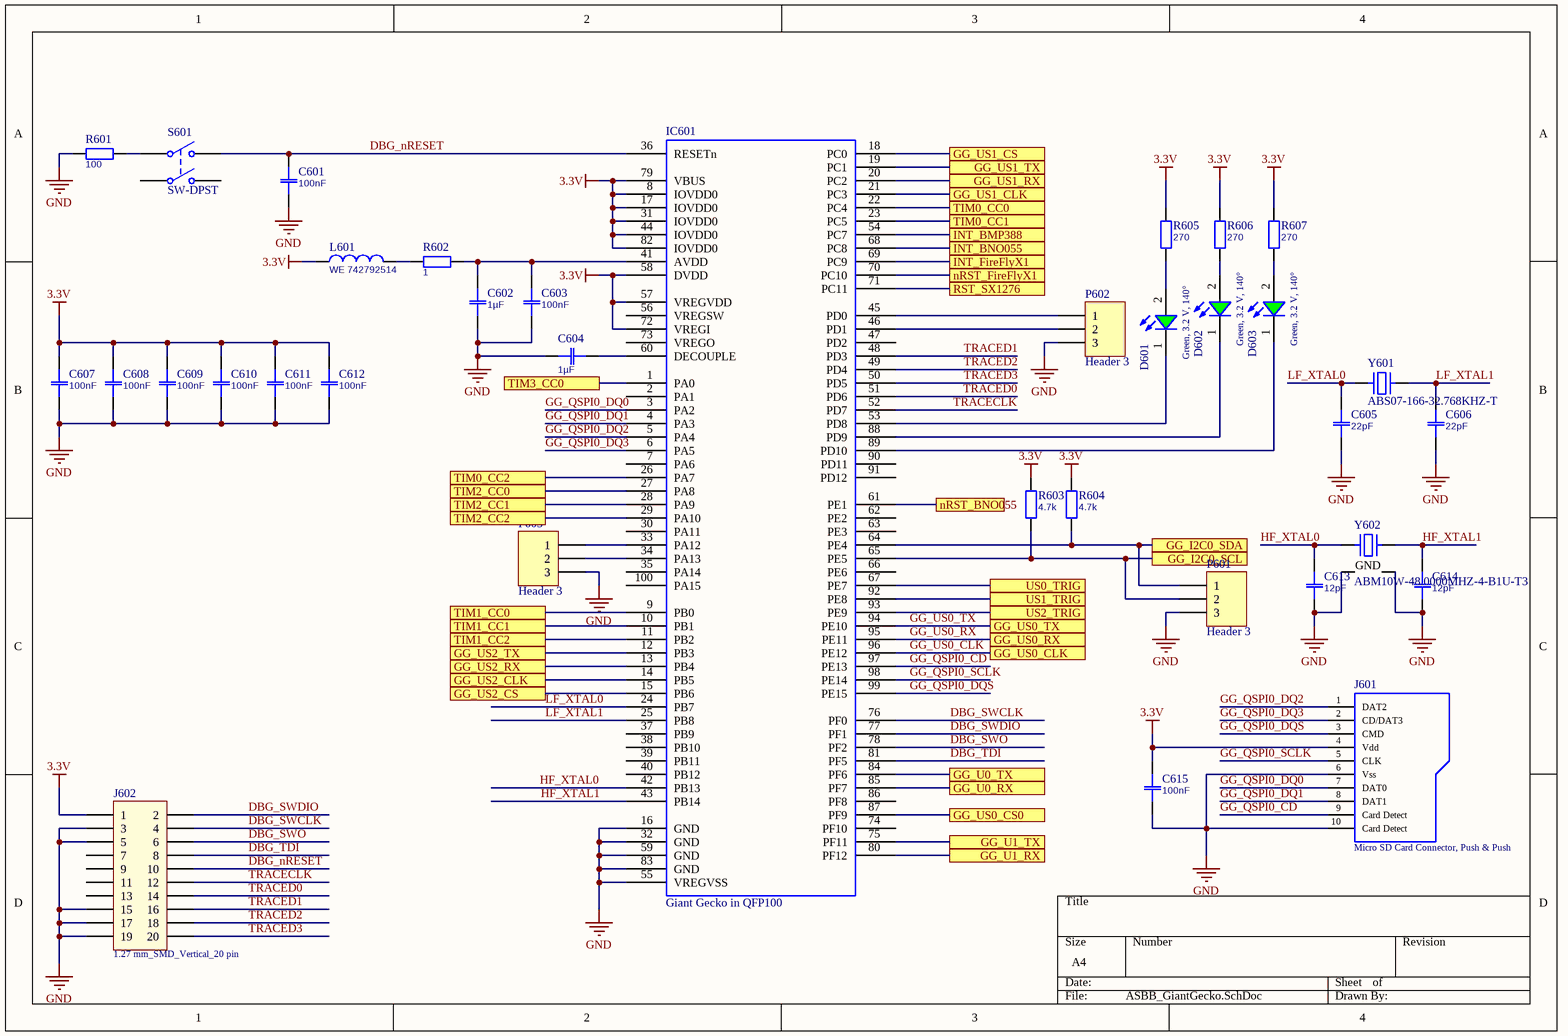
[diagram p10: ASBB_GiantGecko.SchDoc]

### Parts
C601  100nF  [0603]
C602  1µF  [0603]
C603  100nF  [0603]
C604  1µF  [0603]
C605  22pF  [0603]
C606  22pF  [0603]
C607  100nF  [0603]
C608  100nF  [0603]
C609  100nF  [0603]
C610  100nF  [0603]
C611  100nF  [0603]
C612  100nF  [0603]
C613  12pF  [0603]
C614  12pF  [0603]
C615  100nF  [0603]
D601  Green, 3.2 V, 140°  [WL-SMCW_0603]
D602  Green, 3.2 V, 140°  [WL-SMCW_0603]
D603  Green, 3.2 V, 140°  [WL-SMCW_0603]
IC601  Giant Gecko in QFP100  [TQFP100]
J601  Micro SD Card Connector, Push & Push  [693071010811]
J602  1.27 mm_SMD_Vertical_20 pin  [62102021021]
L601  WE 742792514  [1812]
P601  Header 3  [HDR1X3]
P602  Header 3  [HDR1X3]
P603  Header 3  [HDR1X3]
R601  100  [0603]
R602  1  [0603]
R603  4.7k  [0603]
R604  4.7k  [0603]
R605  270  [0603]
R606  270  [0603]
R607  270  [0603]
S601  SW-DPST  [DPST-4]
Y601  ABS07-166-32.768KHZ-T  [ABRACON ABS07]
Y602  ABM10W-48.0000MHZ-4-B1U-T3  [ABRACON ABM10]

### Ports
GG_I2C0_SCL, GG_I2C0_SDA, GG_U0_RX, GG_U0_TX, GG_U1_RX, GG_U1_TX, GG_US0_CLK, GG_US0_CS0, GG_US0_RX, GG_US0_TX, GG_US1_CLK, GG_US1_CS, GG_US1_RX, GG_US1_TX, GG_US2_CLK, GG_US2_CS, GG_US2_RX, GG_US2_TX, INT_BMP388, INT_BNO055, INT_FireFlyX1, nRST_BNO055, nRST_FireFlyX1, RST_SX1276, TIM0_CC0, TIM0_CC1, TIM0_CC2, TIM1_CC0, TIM1_CC1, TIM1_CC2, TIM2_CC0, TIM2_CC1, TIM2_CC2, TIM3_CC0, US0_TRIG, US1_TRIG, US2_TRIG

### Nets
3.3V: C607.1 C608.1 C609.1 C610.1 C611.1 C612.1 C615.1 IC601.8(IOVDD0) IC601.17(IOVDD0) IC601.31(IOVDD0) IC601.44(IOVDD0) IC601.57(VREGVDD) IC601.58(DVDD) IC601.72(VREGI) IC601.79(VBUS) IC601.82(IOVDD0) J601.4(Vdd) J602.1 L601.1 R603.2 R604.2 R605.2 R606.2 R607.2
GND: C601.2 C602.2 C603.2 C604.1 C605.2 C606.2 C607.2 C608.2 C609.2 C610.2 C611.2 C612.2 C613.2 C614.2 C615.2 IC601.16(GND) IC601.32(GND) IC601.55(VREGVSS) IC601.59(GND) IC601.83(GND) J601.6(Vss) J601.10(Card_Detect) J602.3 J602.5 J602.15 J602.17 J602.19 P601.3 P602.3 P603.3 R601.1 Y602.2(GND) Y602.4(GND)
DBG_nRESET: C601.1 IC601.36(RESETn) J602.10 S601.2(NO1)
DBG_SWCLK: IC601.76(PF0) J602.4
DBG_SWDIO: IC601.77(PF1) J602.2
DBG_SWO: IC601.78(PF2) J602.6
DBG_TDI: IC601.81(PF5) J602.8
GG_QSPI0_CD: IC601.97(PE13) J601.9(Card_Detect)
GG_QSPI0_DQ0: IC601.3(PA2) J601.7(DAT0)
GG_QSPI0_DQ1: IC601.4(PA3) J601.8(DAT1)
GG_QSPI0_DQ2: IC601.5(PA4) J601.1(DAT2)
GG_QSPI0_DQ3: IC601.6(PA5) J601.2(CD/DAT3)
GG_QSPI0_DQS: IC601.99(PE15) J601.3(CMD)
GG_QSPI0_SCLK: IC601.98(PE14) J601.5(CLK)
GG_US0_CLK: IC601.96(PE12) ; port GG_US0_CLK
GG_US0_RX: IC601.95(PE11) ; port GG_US0_RX
GG_US0_TX: IC601.94(PE10) ; port GG_US0_TX
HF_XTAL0: C613.1 IC601.42(PB13) Y602.1
HF_XTAL1: C614.1 IC601.43(PB14) Y602.3
HPC_CS0: IC601.15(PB6) ; port GG_US2_CS
HPC_MISO: IC601.12(PB3) ; port GG_US2_TX
HPC_MOSI: IC601.13(PB4) ; port GG_US2_RX
HPC_SCK: IC601.14(PB5) ; port GG_US2_CLK
LF_XTAL0: C605.1 IC601.24(PB7) Y601.1
LF_XTAL1: C606.1 IC601.25(PB8) Y601.2
TRACECLK: IC601.52(PD7) J602.12
TRACED0: IC601.51(PD6) J602.14
TRACED1: IC601.48(PD3) J602.16
TRACED2: IC601.49(PD4) J602.18
TRACED3: IC601.50(PD5) J602.20
NetB501_13: IC601.69(PC9) ; port INT_FireFlyX1
NetB501_19: IC601.70(PC10) ; port nRST_FireFlyX1
NetC602_1: C602.1 C603.1 IC601.41(AVDD) R602.2
NetC604_2: C604.2 IC601.60(DECOUPLE)
NetD601_1: D601.1(K) IC601.53(PD8)
NetD601_2: D601.2(A) R605.1
NetD602_1: D602.1(K) IC601.88(PD9)
NetD602_2: D602.2(A) R606.1
NetD603_1: D603.1(K) IC601.89(PD10)
NetD603_2: D603.2(A) R607.1
NetIC601_1: IC601.1(PA0) ; port TIM3_CC0
NetIC601_9: IC601.9(PB0) ; port TIM1_CC0
NetIC601_10: IC601.10(PB1) ; port TIM1_CC1
NetIC601_11: IC601.11(PB2) ; port TIM1_CC2
NetIC601_18: IC601.18(PC0) ; port GG_US1_CS
NetIC601_19: IC601.19(PC1) ; port GG_US1_TX
NetIC601_20: IC601.20(PC2) ; port GG_US1_RX
NetIC601_21: IC601.21(PC3) ; port GG_US1_CLK
NetIC601_22: IC601.22(PC4) ; port TIM0_CC0
NetIC601_23: IC601.23(PC5) ; port TIM0_CC1
NetIC601_26: IC601.26(PA7) ; port TIM0_CC2
NetIC601_27: IC601.27(PA8) ; port TIM2_CC0
NetIC601_28: IC601.28(PA9) ; port TIM2_CC1
NetIC601_29: IC601.29(PA10) ; port TIM2_CC2
NetIC601_33: IC601.33(PA12) P603.1
NetIC601_34: IC601.34(PA13) P603.2
NetIC601_45: IC601.45(PD0) P602.1
NetIC601_46: IC601.46(PD1) P602.2
NetIC601_54: IC601.54(PC7) ; port INT_BMP388
NetIC601_61: IC601.61(PE1) ; port nRST_BNO055
NetIC601_64: IC601.64(PE4) P601.1 R604.1 ; port GG_I2C0_SDA
NetIC601_65: IC601.65(PE5) P601.2 R603.1 ; port GG_I2C0_SCL
NetIC601_67: IC601.67(PE7) ; port US0_TRIG
NetIC601_68: IC601.68(PC8) ; port INT_BNO055
NetIC601_71: IC601.71(PC11) ; port RST_SX1276
NetIC601_75: IC601.75(PF11) ; port GG_U1_TX
NetIC601_80: IC601.80(PF12) ; port GG_U1_RX
NetIC601_84: IC601.84(PF6) ; port GG_U0_TX
NetIC601_85: IC601.85(PF7) ; port GG_U0_RX
NetIC601_87: IC601.87(PF9) ; port GG_US0_CS0
NetIC601_92: IC601.92(PE8) ; port US1_TRIG
NetIC601_93: IC601.93(PE9) ; port US2_TRIG
NetL601_2: L601.2 R602.1
NetR601_2: R601.2 S601.1(COMMON1)

Not connected (* = marked no-connect by the designer): IC601 2(PA1) 7(PA6) 30(PA11) 35(PA14) 37(PB9) 38(PB10) 39(PB11) 40(PB12) 47(PD2) 56(VREGSW) 62(PE2) 63(PE3) 66(PE6) 73(VREGO) 74(PF10) 86(PF8) 90(PD11) 91(PD12) 100(PA15); J602 7 9 11 13; S601 3(COMMON2) 4(NO2)

### Library data of the parts
C601-C615 = Capacitor: Partnumber: ?; Value: ?
D601-D603 = 150060GS75000: as D1401 on sheet ASBB_USBUART; ComponentLink1Description: Manufacturer; ComponentLink1URL: http://www.we-online.de; ComponentLink2Description: Datasheet; ComponentLink2URL: http://katalog.we-online.de/led/datasheet/150060GS75000.pdf; Part Number: 150060GS75000; Published Date: May 2018; Publisher: Wurth Elektronik; Size: 0603; Viewing Angle: 140°; Operating Temperature: -40 to 85 degC; Emitting Color: Green; Mounting Technology: SMT
IC601 = EFM32GG11B8xx
J601 = 693071010811: WR-CRD Micro SD Card Connector, Push & Push, with card detection; Rated Current: 0.5A; Working Voltage: 500V AC; ComponentLink1Description: Manufacturer; ComponentLink1URL: http://www.we-online.de; ComponentLink2Description: Datasheet; ComponentLink2URL: http://katalog.we-online.de/em/datasheet/693071010811.pdf; Part Number: 693071010811; Published Date: Feb. 2018; Publisher: Wurth Elektronik; Operating Temperature: -25 to 85 degC; Mounting Technology: SMT
J602 = 62102021021: Pin Header WR-PHD, pitch 1.27 mm, SMD, Vertical, dual row, 20 pin; Rated Current: 1 A; Pin Number: 20; Pitch: 1.27 mm; Working Voltage: 100 VAC; Contact Resistance: 20 mOhm; Insulation Resistance: >1000 MOhm; ComponentLink1Description: Manufacturer; ComponentLink1URL: http://www.we-online.de; ComponentLink2Description: Datasheet; ComponentLink2URL: http://katalog.we-online.de/em/datasheet/62102021021.pdf; Part Number: 62102021021; Published Date: Jan. 2018; Publisher: Wurth Elektronik; Operating Temperature: -40 to 105 degC; Mounting Technology: SMD; Row Number: Dual; Orientation: Vertical
L601 = Inductor: Partnumber: ?; Value: ?
P601-P603 = Header 3: Header, 3-Pin; LatestRevisionDate: 17-Jul-2002; LatestRevisionNote: Re-released for DXP Platform.; Publisher: Altium Limited
R601-R607 = Resistor: Partnumber: ?; Value: ?
S601 = SW-DPST: Double-Pole, Single-Throw Switch; Published: 24-Mar-1999; LatestRevisionDate: 17-Jul-2002; LatestRevisionNote: Re-released for DXP Platform.; PackageReference: DPST-4; Publisher: Altium Limited; PackageDescription: Switch; 4 Leads
Y601 = Abracon Crystal ABS06: SMT Crystal
Y602 = Abracon Crystal ABM10: SMT Crystal

## Sheet ASBB_Servo.SchDoc
size A4
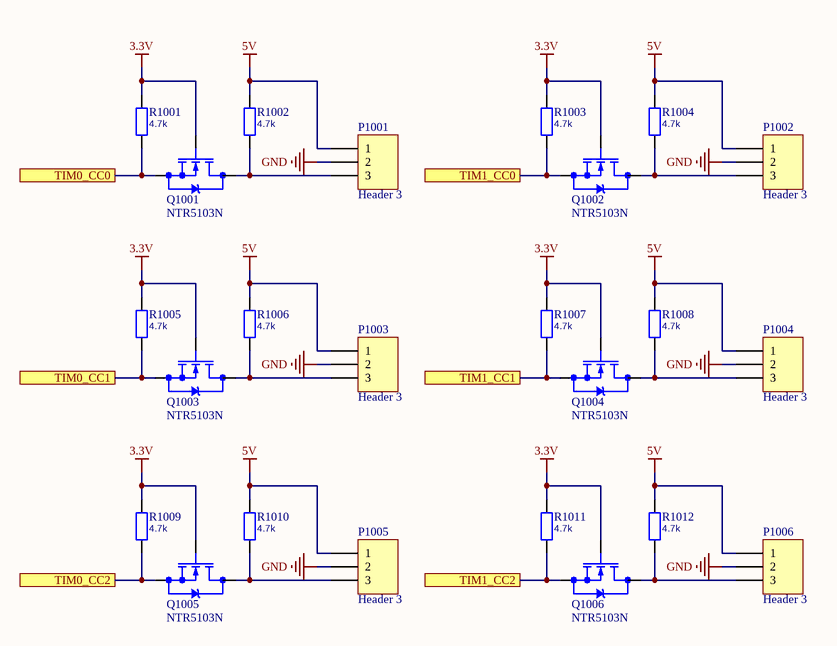
[diagram p11: ASBB_Servo.SchDoc]

### Parts
P1001  Header 3  [HDR1X3]
P1002  Header 3  [HDR1X3]
P1003  Header 3  [HDR1X3]
P1004  Header 3  [HDR1X3]
P1005  Header 3  [HDR1X3]
P1006  Header 3  [HDR1X3]
Q1001  NTR5103N  [SOT23]
Q1002  NTR5103N  [SOT23]
Q1003  NTR5103N  [SOT23]
Q1004  NTR5103N  [SOT23]
Q1005  NTR5103N  [SOT23]
Q1006  NTR5103N  [SOT23]
R1001  4.7k  [0603]
R1002  4.7k  [0603]
R1003  4.7k  [0603]
R1004  4.7k  [0603]
R1005  4.7k  [0603]
R1006  4.7k  [0603]
R1007  4.7k  [0603]
R1008  4.7k  [0603]
R1009  4.7k  [0603]
R1010  4.7k  [0603]
R1011  4.7k  [0603]
R1012  4.7k  [0603]

### Ports
TIM0_CC0, TIM0_CC1, TIM0_CC2, TIM1_CC0, TIM1_CC1, TIM1_CC2

### Nets
3.3V: Q1001.1(G) Q1002.1(G) Q1003.1(G) Q1004.1(G) Q1005.1(G) Q1006.1(G) R1001.2 R1003.2 R1005.2 R1007.2 R1009.2 R1011.2
5V: P1001.1 P1002.1 P1003.1 P1004.1 P1005.1 P1006.1 R1002.2 R1004.2 R1006.2 R1008.2 R1010.2 R1012.2
GND: P1001.2 P1002.2 P1003.2 P1004.2 P1005.2 P1006.2
NetIC901_30: Q1006.2(S) R1011.1 ; port TIM1_CC2
NetIC901_31: Q1004.2(S) R1007.1 ; port TIM1_CC1
NetIC901_45: Q1001.2(S) R1001.1 ; port TIM0_CC0
NetIC901_47: Q1003.2(S) R1005.1 ; port TIM0_CC1
NetIC901_49: Q1005.2(S) R1009.1 ; port TIM0_CC2
NetIC901_51: Q1002.2(S) R1003.1 ; port TIM1_CC0
NetP1001_3: P1001.3 Q1001.3(D) R1002.1
NetP1002_3: P1002.3 Q1002.3(D) R1004.1
NetP1003_3: P1003.3 Q1003.3(D) R1006.1
NetP1004_3: P1004.3 Q1004.3(D) R1008.1
NetP1005_3: P1005.3 Q1005.3(D) R1010.1
NetP1006_3: P1006.3 Q1006.3(D) R1012.1

### Library data of the parts
P1001-P1006 = Header 3: Header, 3-Pin; LatestRevisionDate: 17-Jul-2002; LatestRevisionNote: Re-released for DXP Platform.; Publisher: Altium Limited
Q1001-Q1006 = NMOS SOT23: N-Channel MOSFET SOT23; Value: ?; Partnumber: ?
R1001-R1012 = Resistor: Partnumber: ?; Value: ?

## Sheet ASBB_MightyGecko.SchDoc
size A4
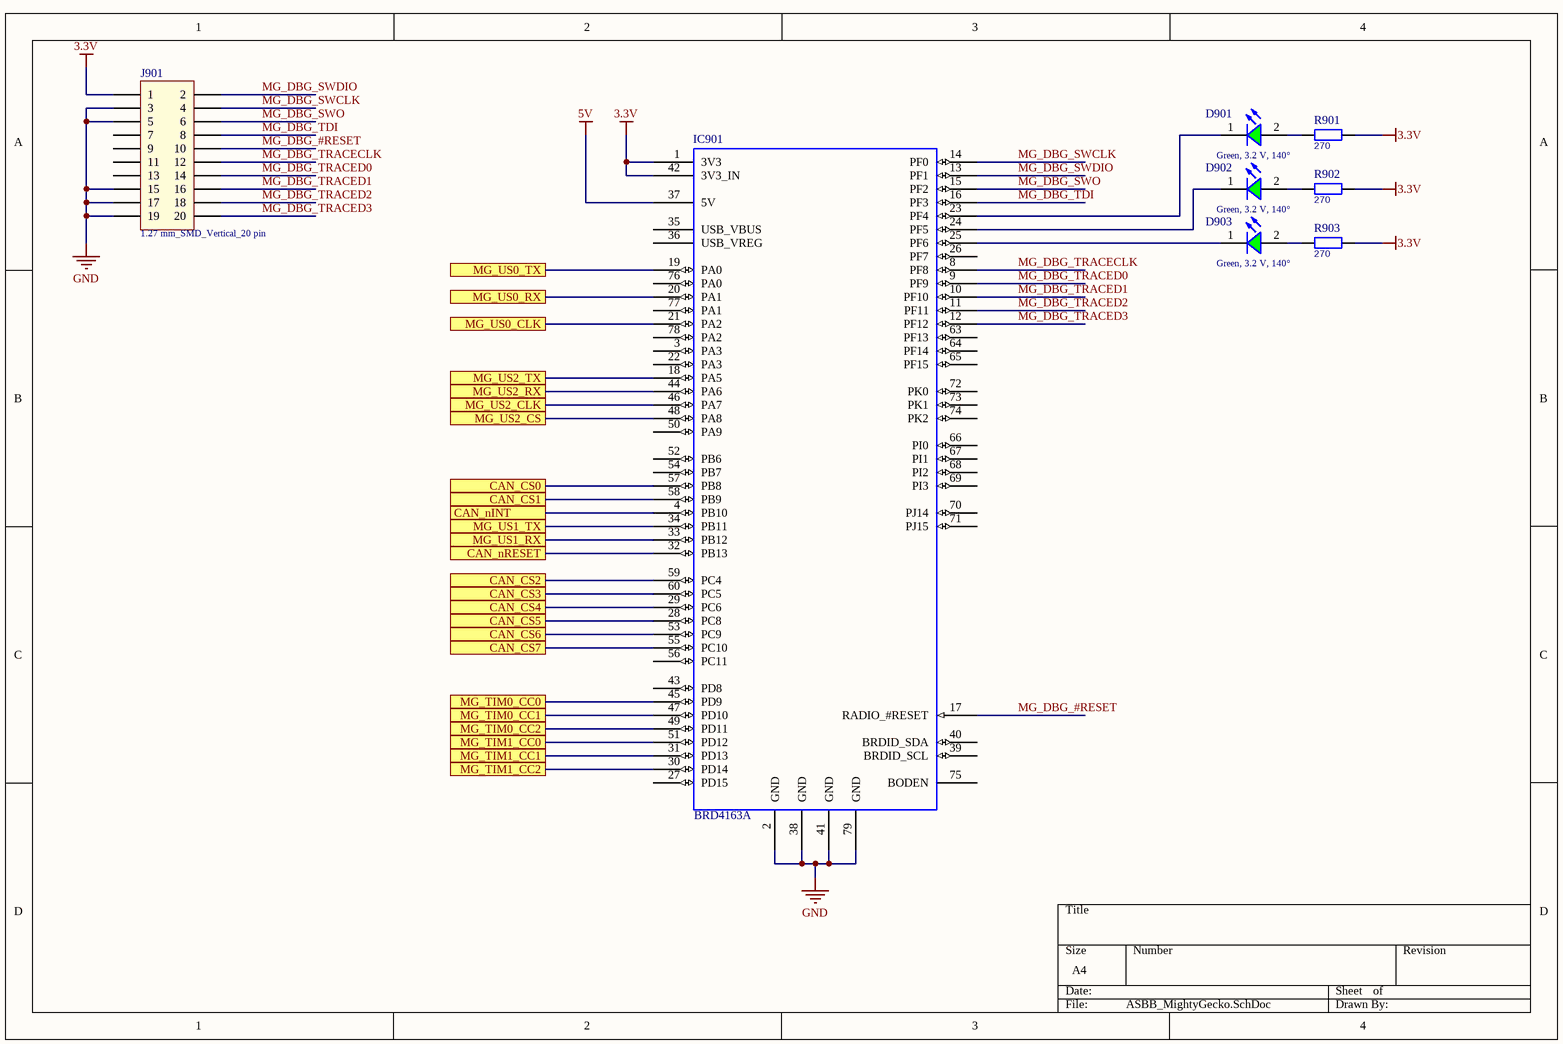
[diagram p12: ASBB_MightyGecko.SchDoc]

### Parts
D901  Green, 3.2 V, 140°  [WL-SMCW_0603]
D902  Green, 3.2 V, 140°  [WL-SMCW_0603]
D903  Green, 3.2 V, 140°  [WL-SMCW_0603]
IC901  BRD4163A  [80-Pin SiLabs Module]
J901  1.27 mm_SMD_Vertical_20 pin  [62102021021]
R901  270  [0603]
R902  270  [0603]
R903  270  [0603]

### Ports
CAN_CS0, CAN_CS1, CAN_CS2, CAN_CS3, CAN_CS4, CAN_CS5, CAN_CS6, CAN_CS7, CAN_nINT, CAN_nRESET, MG_TIM0_CC0, MG_TIM0_CC1, MG_TIM0_CC2, MG_TIM1_CC0, MG_TIM1_CC1, MG_TIM1_CC2, MG_US0_CLK, MG_US0_RX, MG_US0_TX, MG_US1_RX, MG_US1_TX, MG_US2_CLK, MG_US2_CS, MG_US2_RX, MG_US2_TX

### Nets
3.3V: IC901.1(3V3) IC901.42(3V3_IN) J901.1 R901.2 R902.2 R903.2
5V: IC901.37(5V)
GND: IC901.2(GND) IC901.38(GND) IC901.41(GND) IC901.79(GND) J901.3 J901.5 J901.15 J901.17 J901.19
HPC_CS1: IC901.48(PA8) ; port MG_US2_CS
HPC_SCK: IC901.46(PA7) ; port MG_US2_CLK
MG_DBG_#RESET: IC901.17(RADIO_#RESET) J901.10
MG_DBG_SWCLK: IC901.14(PF0) J901.4
MG_DBG_SWDIO: IC901.13(PF1) J901.2
MG_DBG_SWO: IC901.15(PF2) J901.6
MG_DBG_TDI: IC901.16(PF3) J901.8
MG_DBG_TRACECLK: IC901.8(PF8) J901.12
MG_DBG_TRACED0: IC901.9(PF9) J901.14
MG_DBG_TRACED1: IC901.10(PF10) J901.16
MG_DBG_TRACED2: IC901.11(PF11) J901.18
MG_DBG_TRACED3: IC901.12(PF12) J901.20
NetD901_1: D901.1(K) IC901.23(PF4)
NetD901_2: D901.2(A) R901.1
NetD902_1: D902.1(K) IC901.24(PF5)
NetD902_2: D902.2(A) R902.1
NetD903_1: D903.1(K) IC901.25(PF6)
NetD903_2: D903.2(A) R903.1
NetIC901_4: IC901.4(PB10) ; port CAN_nINT
NetIC901_18: IC901.18(PA5) ; port MG_US2_TX
NetIC901_19: IC901.19(PA0) ; port MG_US0_TX
NetIC901_20: IC901.20(PA1) ; port MG_US0_RX
NetIC901_21: IC901.21(PA2) ; port MG_US0_CLK
NetIC901_28: IC901.28(PC8) ; port CAN_CS5
NetIC901_29: IC901.29(PC6) ; port CAN_CS4
NetIC901_30: IC901.30(PD14) ; port MG_TIM1_CC2
NetIC901_31: IC901.31(PD13) ; port MG_TIM1_CC1
NetIC901_32: IC901.32(PB13) ; port CAN_nRESET
NetIC901_33: IC901.33(PB12) ; port MG_US1_RX
NetIC901_34: IC901.34(PB11) ; port MG_US1_TX
NetIC901_44: IC901.44(PA6) ; port MG_US2_RX
NetIC901_45: IC901.45(PD9) ; port MG_TIM0_CC0
NetIC901_47: IC901.47(PD10) ; port MG_TIM0_CC1
NetIC901_49: IC901.49(PD11) ; port MG_TIM0_CC2
NetIC901_51: IC901.51(PD12) ; port MG_TIM1_CC0
NetIC901_53: IC901.53(PC9) ; port CAN_CS6
NetIC901_55: IC901.55(PC10) ; port CAN_CS7
NetIC901_57: IC901.57(PB8) ; port CAN_CS0
NetIC901_58: IC901.58(PB9) ; port CAN_CS1
NetIC901_59: IC901.59(PC4) ; port CAN_CS2
NetIC901_60: IC901.60(PC5) ; port CAN_CS3

Not connected (* = marked no-connect by the designer): IC901 3(PA3) 5(NC) 6(NC) 7(NC) 22(PA3) 26(PF7) 27(PD15) 35(USB_VBUS) 36(USB_VREG) 39(BRDID_SCL) 40(BRDID_SDA) 43(PD8) 50(PA9) 52(PB6) 54(PB7) 56(PC11) 61(NC) 62(NC) 63(PF13) 64(PF14) 65(PF15) 66(PI0) 67(PI1) 68(PI2) 69(PI3) 70(PJ14) 71(PJ15) 72(PK0) 73(PK1) 74(PK2) 75(BODEN) 76(PA0) 77(PA1) 78(PA2) 80(NC); J901 7 9 11 13

### Library data of the parts
D901-D903 = 150060GS75000: as D1401 on sheet ASBB_USBUART; ComponentLink1Description: Manufacturer; ComponentLink1URL: http://www.we-online.de; ComponentLink2Description: Datasheet; ComponentLink2URL: http://katalog.we-online.de/led/datasheet/150060GS75000.pdf; Part Number: 150060GS75000; Published Date: May 2018; Publisher: Wurth Elektronik; Size: 0603; Viewing Angle: 140°; Operating Temperature: -40 to 85 degC; Emitting Color: Green; Mounting Technology: SMT
IC901 = SLWRB4163A
J901 = 62102021021: as J602 on sheet ASBB_GiantGecko; ComponentLink1Description: Manufacturer; ComponentLink1URL: http://www.we-online.de; ComponentLink2Description: Datasheet; ComponentLink2URL: http://katalog.we-online.de/em/datasheet/62102021021.pdf; Part Number: 62102021021; Published Date: Jan. 2018; Publisher: Wurth Elektronik; Operating Temperature: -40 to 105 degC; Mounting Technology: SMD; Row Number: Dual; Orientation: Vertical
R901-R903 = Resistor: Partnumber: ?; Value: ?

## Sheet ASBB_SPICrossbar.SchDoc
size A4
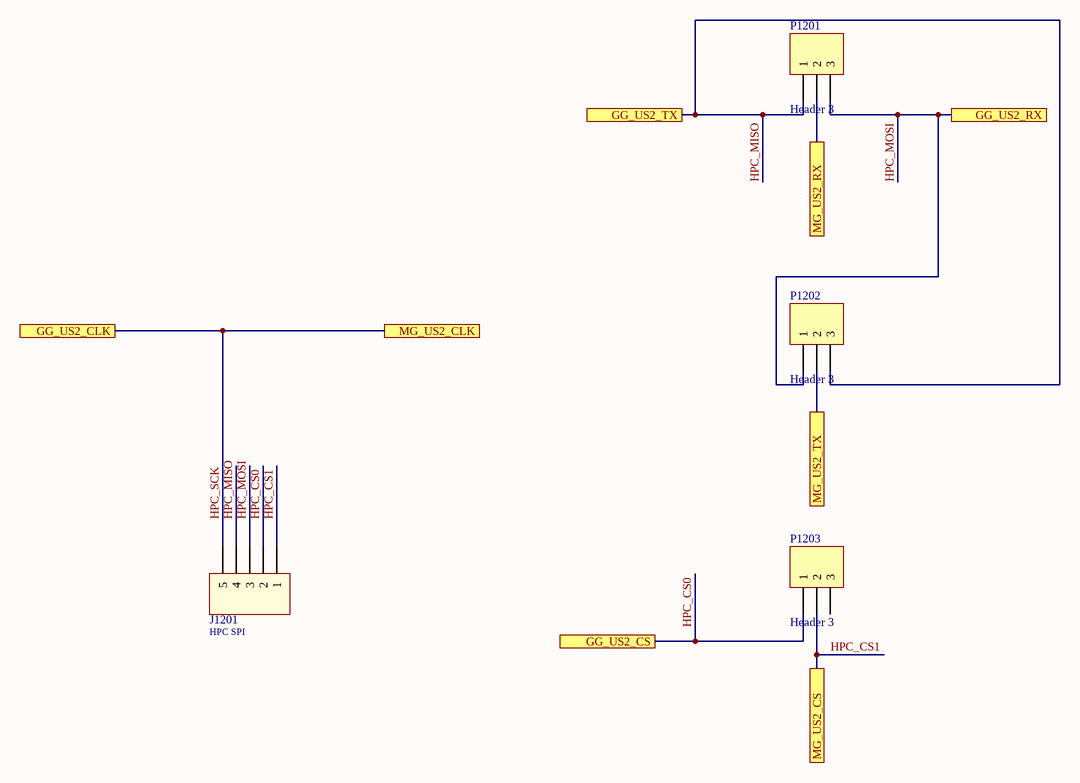
[diagram p13: ASBB_SPICrossbar.SchDoc]

### Parts
J1201  HPC SPI  [61000511921]
P1201  Header 3  [HDR1X3]
P1202  Header 3  [HDR1X3]
P1203  Header 3  [HDR1X3]

### Ports
GG_US2_CLK, GG_US2_CS, GG_US2_RX, GG_US2_TX, MG_US2_CLK, MG_US2_CS, MG_US2_RX, MG_US2_TX

### Nets
HPC_CS0: J1201.2 P1203.1 ; port GG_US2_CS
HPC_CS1: J1201.1 P1203.2 ; port MG_US2_CS
HPC_MISO: J1201.4 P1201.1 P1202.3 ; port GG_US2_TX
HPC_MOSI: J1201.3 P1201.3 P1202.1 ; port GG_US2_RX
HPC_SCK: J1201.5 ; port GG_US2_CLK, port MG_US2_CLK
NetIC901_18: P1202.2 ; port MG_US2_TX
NetIC901_44: P1201.2 ; port MG_US2_RX

Not connected (* = marked no-connect by the designer): P1203 3

### Library data of the parts
J1201 = 61000511921: Socket Header WR-PHD, Pitch 2.54 mm, SMT, Vertical, single row, 5 pin; Rated Current: 3 A; Pin Number: 5; Pitch: 2.54 mm; Working Voltage: 250 VAC; Contact Resistance: 20 mOhm; Insulation Resistance: >1000 MOhm; ComponentLink1Description: Manufacturer; ComponentLink1URL: http://www.we-online.de; ComponentLink2Description: Datasheet; ComponentLink2URL: http://katalog.we-online.com/em/datasheet/6100xx11921.pdf; Part Number: 61000511921; Published Date: Jan. 2018; Publisher: Wurth Elektronik; Operating Temperature: -40 to 125 degC; Mounting Technology: SMT; Row Number: single; Orientation: Vertical
P1201-P1203 = Header 3: Header, 3-Pin; LatestRevisionDate: 17-Jul-2002; LatestRevisionNote: Re-released for DXP Platform.; Publisher: Altium Limited

## Sheet ASBB_Sonar.SchDoc
size A4
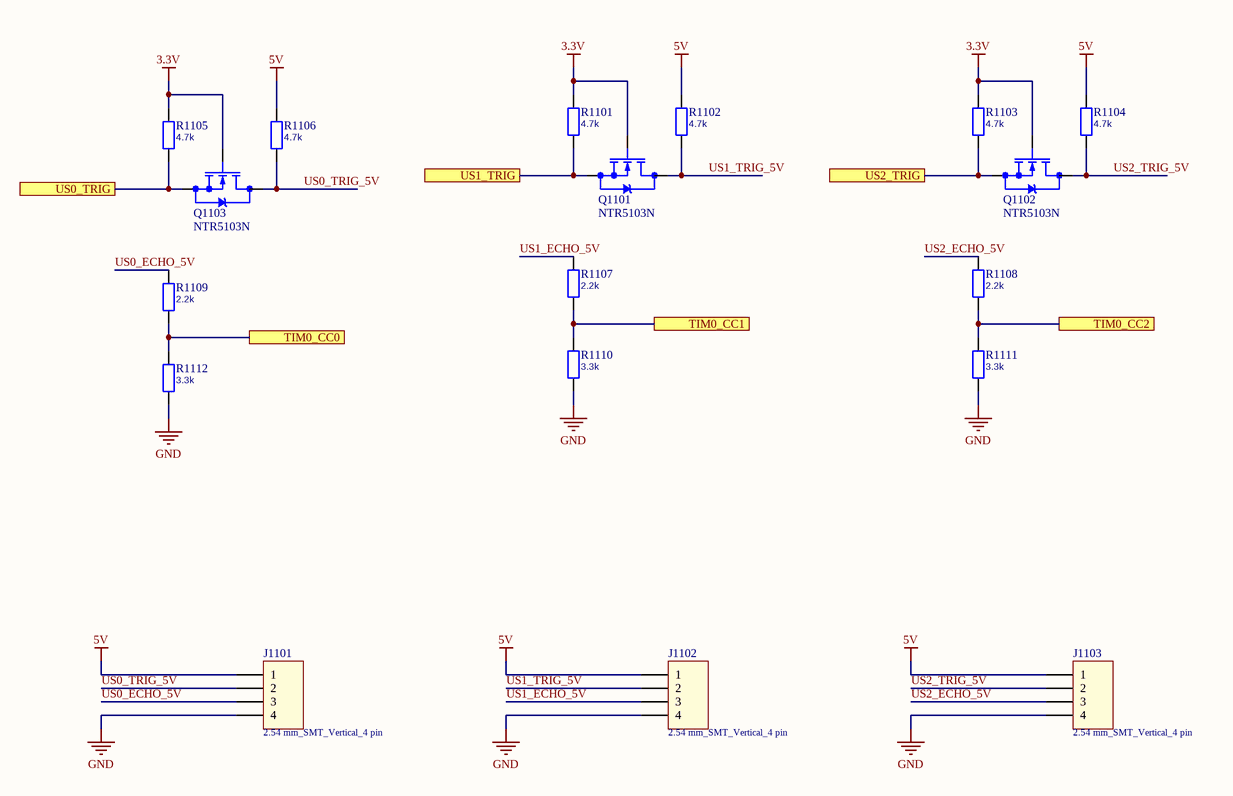
[diagram p14: ASBB_Sonar.SchDoc]

### Parts
J1101  2.54 mm_SMT_Vertical_4 pin  [61000411921]
J1102  2.54 mm_SMT_Vertical_4 pin  [61000411921]
J1103  2.54 mm_SMT_Vertical_4 pin  [61000411921]
Q1101  NTR5103N  [SOT23]
Q1102  NTR5103N  [SOT23]
Q1103  NTR5103N  [SOT23]
R1101  4.7k  [0603]
R1102  4.7k  [0603]
R1103  4.7k  [0603]
R1104  4.7k  [0603]
R1105  4.7k  [0603]
R1106  4.7k  [0603]
R1107  2.2k  [0603]
R1108  2.2k  [0603]
R1109  2.2k  [0603]
R1110  3.3k  [0603]
R1111  3.3k  [0603]
R1112  3.3k  [0603]

### Ports
TIM0_CC0, TIM0_CC1, TIM0_CC2, US0_TRIG, US1_TRIG, US2_TRIG

### Nets
3.3V: Q1101.1(G) Q1102.1(G) Q1103.1(G) R1101.2 R1103.2 R1105.2
5V: J1101.1 J1102.1 J1103.1 R1102.2 R1104.2 R1106.2
GND: J1101.4 J1102.4 J1103.4 R1110.1 R1111.1 R1112.1
US0_ECHO_5V: J1101.3 R1109.2
US0_TRIG_5V: J1101.2 Q1103.3(D) R1106.1
US1_ECHO_5V: J1102.3 R1107.2
US1_TRIG_5V: J1102.2 Q1101.3(D) R1102.1
US2_ECHO_5V: J1103.3 R1108.2
US2_TRIG_5V: J1103.2 Q1102.3(D) R1104.1
NetIC601_22: R1109.1 R1112.2 ; port TIM0_CC0
NetIC601_23: R1107.1 R1110.2 ; port TIM0_CC1
NetIC601_26: R1108.1 R1111.2 ; port TIM0_CC2
NetIC601_67: Q1103.2(S) R1105.1 ; port US0_TRIG
NetIC601_92: Q1101.2(S) R1101.1 ; port US1_TRIG
NetIC601_93: Q1102.2(S) R1103.1 ; port US2_TRIG

### Library data of the parts
J1101-J1103 = 61000411921: Socket Header WR-PHD, Pitch 2.54 mm, SMT, Vertical, single row, 4 pin; Rated Current: 3 A; Pin Number: 4; Pitch: 2.54 mm; Working Voltage: 250 VAC; Contact Resistance: 20 mOhm; Insulation Resistance: >1000 MOhm; ComponentLink1Description: Manufacturer; ComponentLink1URL: http://www.we-online.de; ComponentLink2Description: Datasheet; ComponentLink2URL: http://katalog.we-online.com/em/datasheet/6100xx11921.pdf; Part Number: 61000411921; Published Date: Jan. 2018; Publisher: Wurth Elektronik; Operating Temperature: -40 to 125 degC; Mounting Technology: SMT; Row Number: single; Orientation: Vertical
Q1101-Q1103 = NMOS SOT23: N-Channel MOSFET SOT23; Value: ?; Partnumber: ?
R1101-R1112 = Resistor: Partnumber: ?; Value: ?

## Sheet ASBB_WheelSpeed.SchDoc
size A4
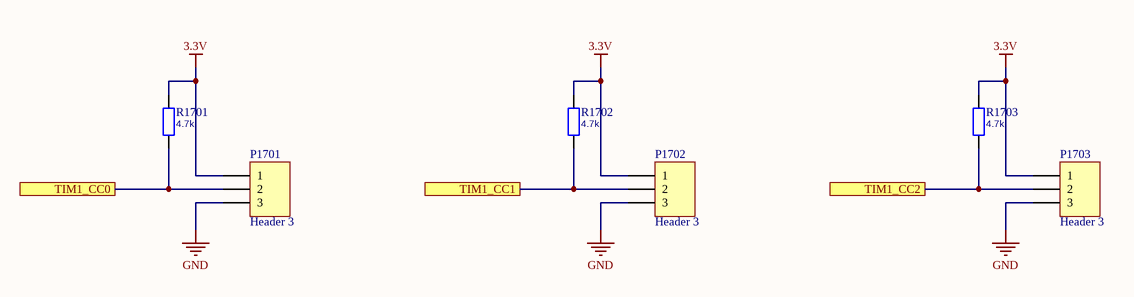
[diagram p15: ASBB_WheelSpeed.SchDoc]

### Parts
P1701  Header 3  [HDR1X3]
P1702  Header 3  [HDR1X3]
P1703  Header 3  [HDR1X3]
R1701  4.7k  [0603]
R1702  4.7k  [0603]
R1703  4.7k  [0603]

### Ports
TIM1_CC0, TIM1_CC1, TIM1_CC2

### Nets
3.3V: P1701.1 P1702.1 P1703.1 R1701.2 R1702.2 R1703.2
GND: P1701.3 P1702.3 P1703.3
NetIC601_9: P1701.2 R1701.1 ; port TIM1_CC0
NetIC601_10: P1702.2 R1702.1 ; port TIM1_CC1
NetIC601_11: P1703.2 R1703.1 ; port TIM1_CC2

### Library data of the parts
P1701-P1703 = Header 3: Header, 3-Pin; LatestRevisionDate: 17-Jul-2002; LatestRevisionNote: Re-released for DXP Platform.; Publisher: Altium Limited
R1701-R1703 = Resistor: Partnumber: ?; Value: ?

## Sheet ASBB_VIN.SchDoc
size A4
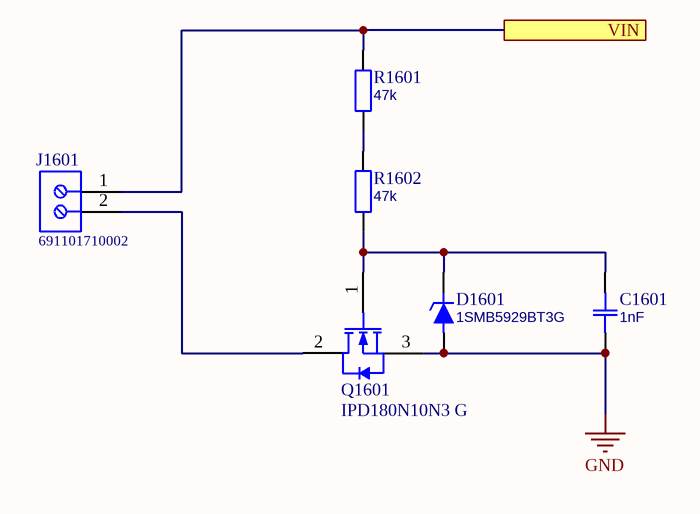
[diagram p16: ASBB_VIN.SchDoc]

### Parts
C1601  1nF  [0603]
D1601  1SMB5929BT3G  [SMB]
J1601  691101710002  [691101710002]
Q1601  IPD180N10N3 G  [INF-PG-TO252-3-11_A_N]
R1601  47k  [0603]
R1602  47k  [0603]

### Ports
VIN

### Nets
GND: C1601.2 D1601.2(A) Q1601.3(SOURCE)
V_IN: J1601.1 R1601.2 ; port VIN
NetC1601_1: C1601.1 D1601.1(C) Q1601.1(GATE) R1602.1
NetJ1601_2: J1601.2 Q1601.2(DRAIN)
NetR1601_1: R1601.1 R1602.2

### Library data of the parts
C1601 = Capacitor: Partnumber: ?; Value: ?
D1601 = Diode Zener: Zener Diode / Varistor unipolar; Partnumber: ?; Value: ?
J1601 = 691101710002: as J1501 on sheet ASBB_VarBuck; ComponentLink1Description: Manufacturer; ComponentLink1URL: http://www.we-online.de; ComponentLink2Description: Datasheet; ComponentLink2URL: http://katalog.we-online.de/em/datasheet/6911017100xx.pdf; Part Number: 691101710002; Published Date: May 2018; Publisher: Wurth Elektronik; Operating Temperature: -40 to 105 degC; Mounting Technology: THT; Packaging: Box
Q1601 = IPD180N10N3 G: as Q1501 on sheet ASBB_VarBuck; DatasheetVersion: Rev. 2.2; PackageVersion: Rev. 02, 03/2007; PackageReference: PG-TO252-3-11; PackageDescription: 3-Pin Plastic (Green) Transistor Single Outline Package, 6.57 x 6.1 mm Body, 2.29 mm Pitch; Supplier 1: Digi-Key; Supplier Part Number 1: IPD180N10N3 GTR-ND; Supplier 2: Digi-Key; Supplier Part Number 2: IPD180N10N3 GCT-ND; Supplier 3: Digi-Key; Supplier Part Number 3: IPD180N10N3 GDKR-ND; Packing: Reel; RthJC (max): 2.1 K/W; Mounting Technology: Surface Mount; PartNumber: IPD180N10N3 G; ComponentLink1Description: Manufacturer URL; ComponentLink1URL: http://www.infineon.com/; ComponentLink2Description: Datasheet; ComponentLink2URL: http://www.infineon.com/dgdl/IPD180N10N3+G_Rev2.2.pdf?folderId=db3a304313b8b5a60113cee8763b02d7&fileId=db3a30432239cccd01226070a4bb7fb9; ComponentLink3Description: Package Specification; ComponentLink3URL: http://www.infineon.com/dgdl/IPD160N04L_rev1.0.pdf?folderId=db3a3043163797a6011643468e7505a4&fileId=db3a3043163797a60116436401cf05cf
R1601 R1602 = Resistor: Partnumber: ?; Value: ?

## Sheet ASBB_ADC.SchDoc
size A4
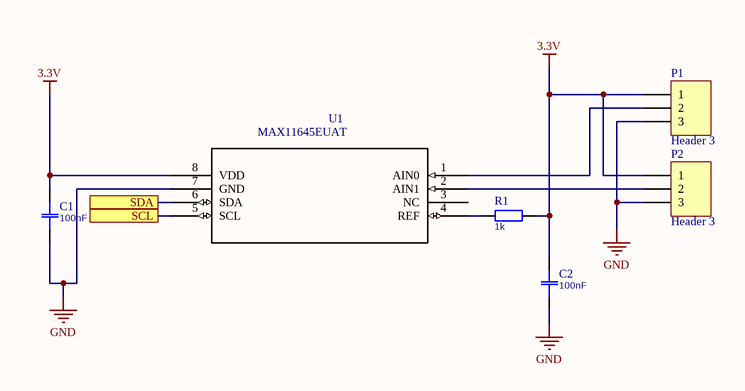
[diagram p17: ASBB_ADC.SchDoc]

### Parts
C1  100nF  [0603]
C2  100nF  [0603]
P1  Header 3  [HDR1X3]
P2  Header 3  [HDR1X3]
R1  1k  [0603]
U1  MAX11645EUAT  [21-0036K]

### Ports
SCL, SDA

### Nets
3.3V: C1.1 C2.1 P1.1 P2.1 R1.1 U1.8(VDD)
GND: C1.2 C2.2 P1.3 P2.3 U1.7(GND)
NetIC601_64: U1.6(SDA) ; port SDA
NetIC601_65: U1.5(SCL) ; port SCL
NetP1_2: P1.2 U1.1(AIN0)
NetP2_2: P2.2 U1.2(AIN1)
NetR1_2: R1.2 U1.4(REF)

Not connected (* = marked no-connect by the designer): U1 3(NC)

### Library data of the parts
C1 C2 = Capacitor: Partnumber: ?; Value: ?
P1 P2 = Header 3: Header, 3-Pin; LatestRevisionDate: 17-Jul-2002; LatestRevisionNote: Re-released for DXP Platform.; Publisher: Altium Limited
R1 = Resistor: Partnumber: ?; Value: ?
U1 = MAX11645EUAT: Data acquisition IC - AD converter _ADC_ Maxim Integrated MAX11645EUA+ External , Internal uMAX 8; Digi-Key_Purchase_URL: https://www.digikey.de/product-detail/en/maxim-integrated/MAX11645EUA-/MAX11645EUA--ND/2349323?utm_source=snapeda&utm_medium=aggregator&utm_campaign=symbol; MF: Maxim Integrated; Digi-Key_Part_Number: MAX11645EUA+-ND; SnapEDA_Link: https://www.snapeda.com/parts/MAX11645EUA%2B/Maxim%20Integrated/view-part/?ref=snap; Package: MSOP-8 Maxim Integrated; MP: MAX11645EUA+; Value: *